# EAGLE design TeensyBreakout_Alpha1a (EAGLE 9.0.1)
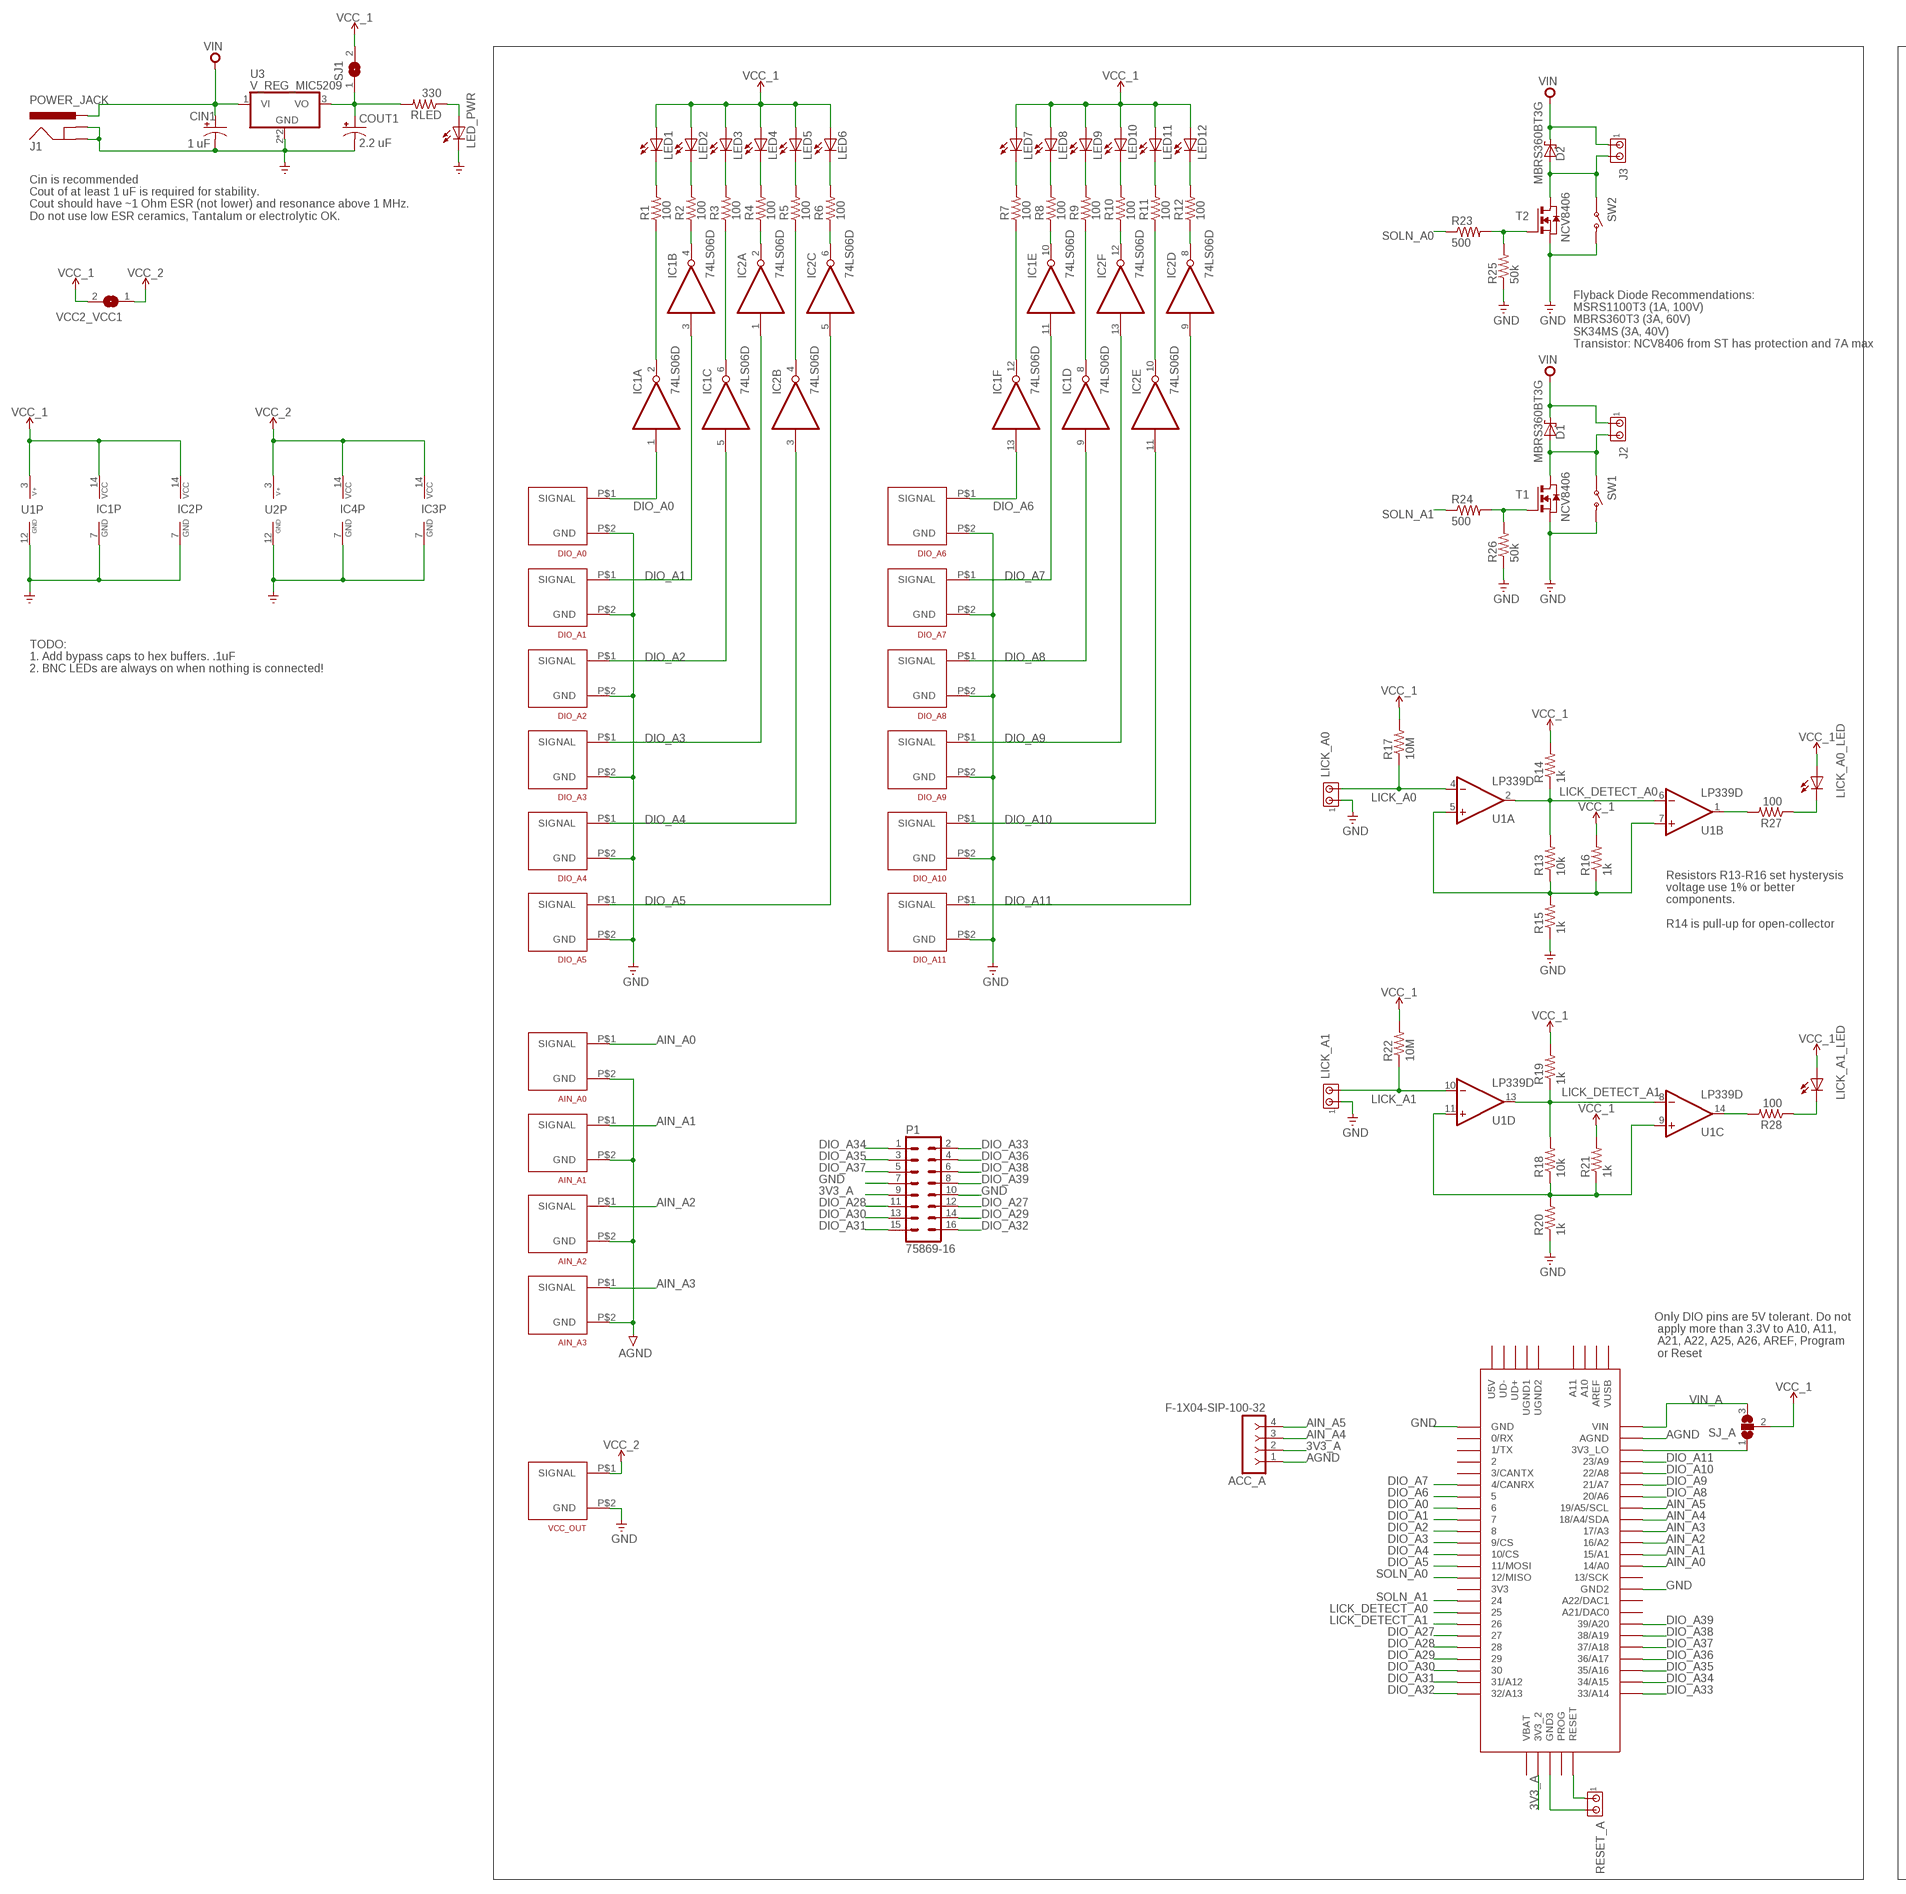
[diagram p0: schematic, sheet 1, part 1 of 2]
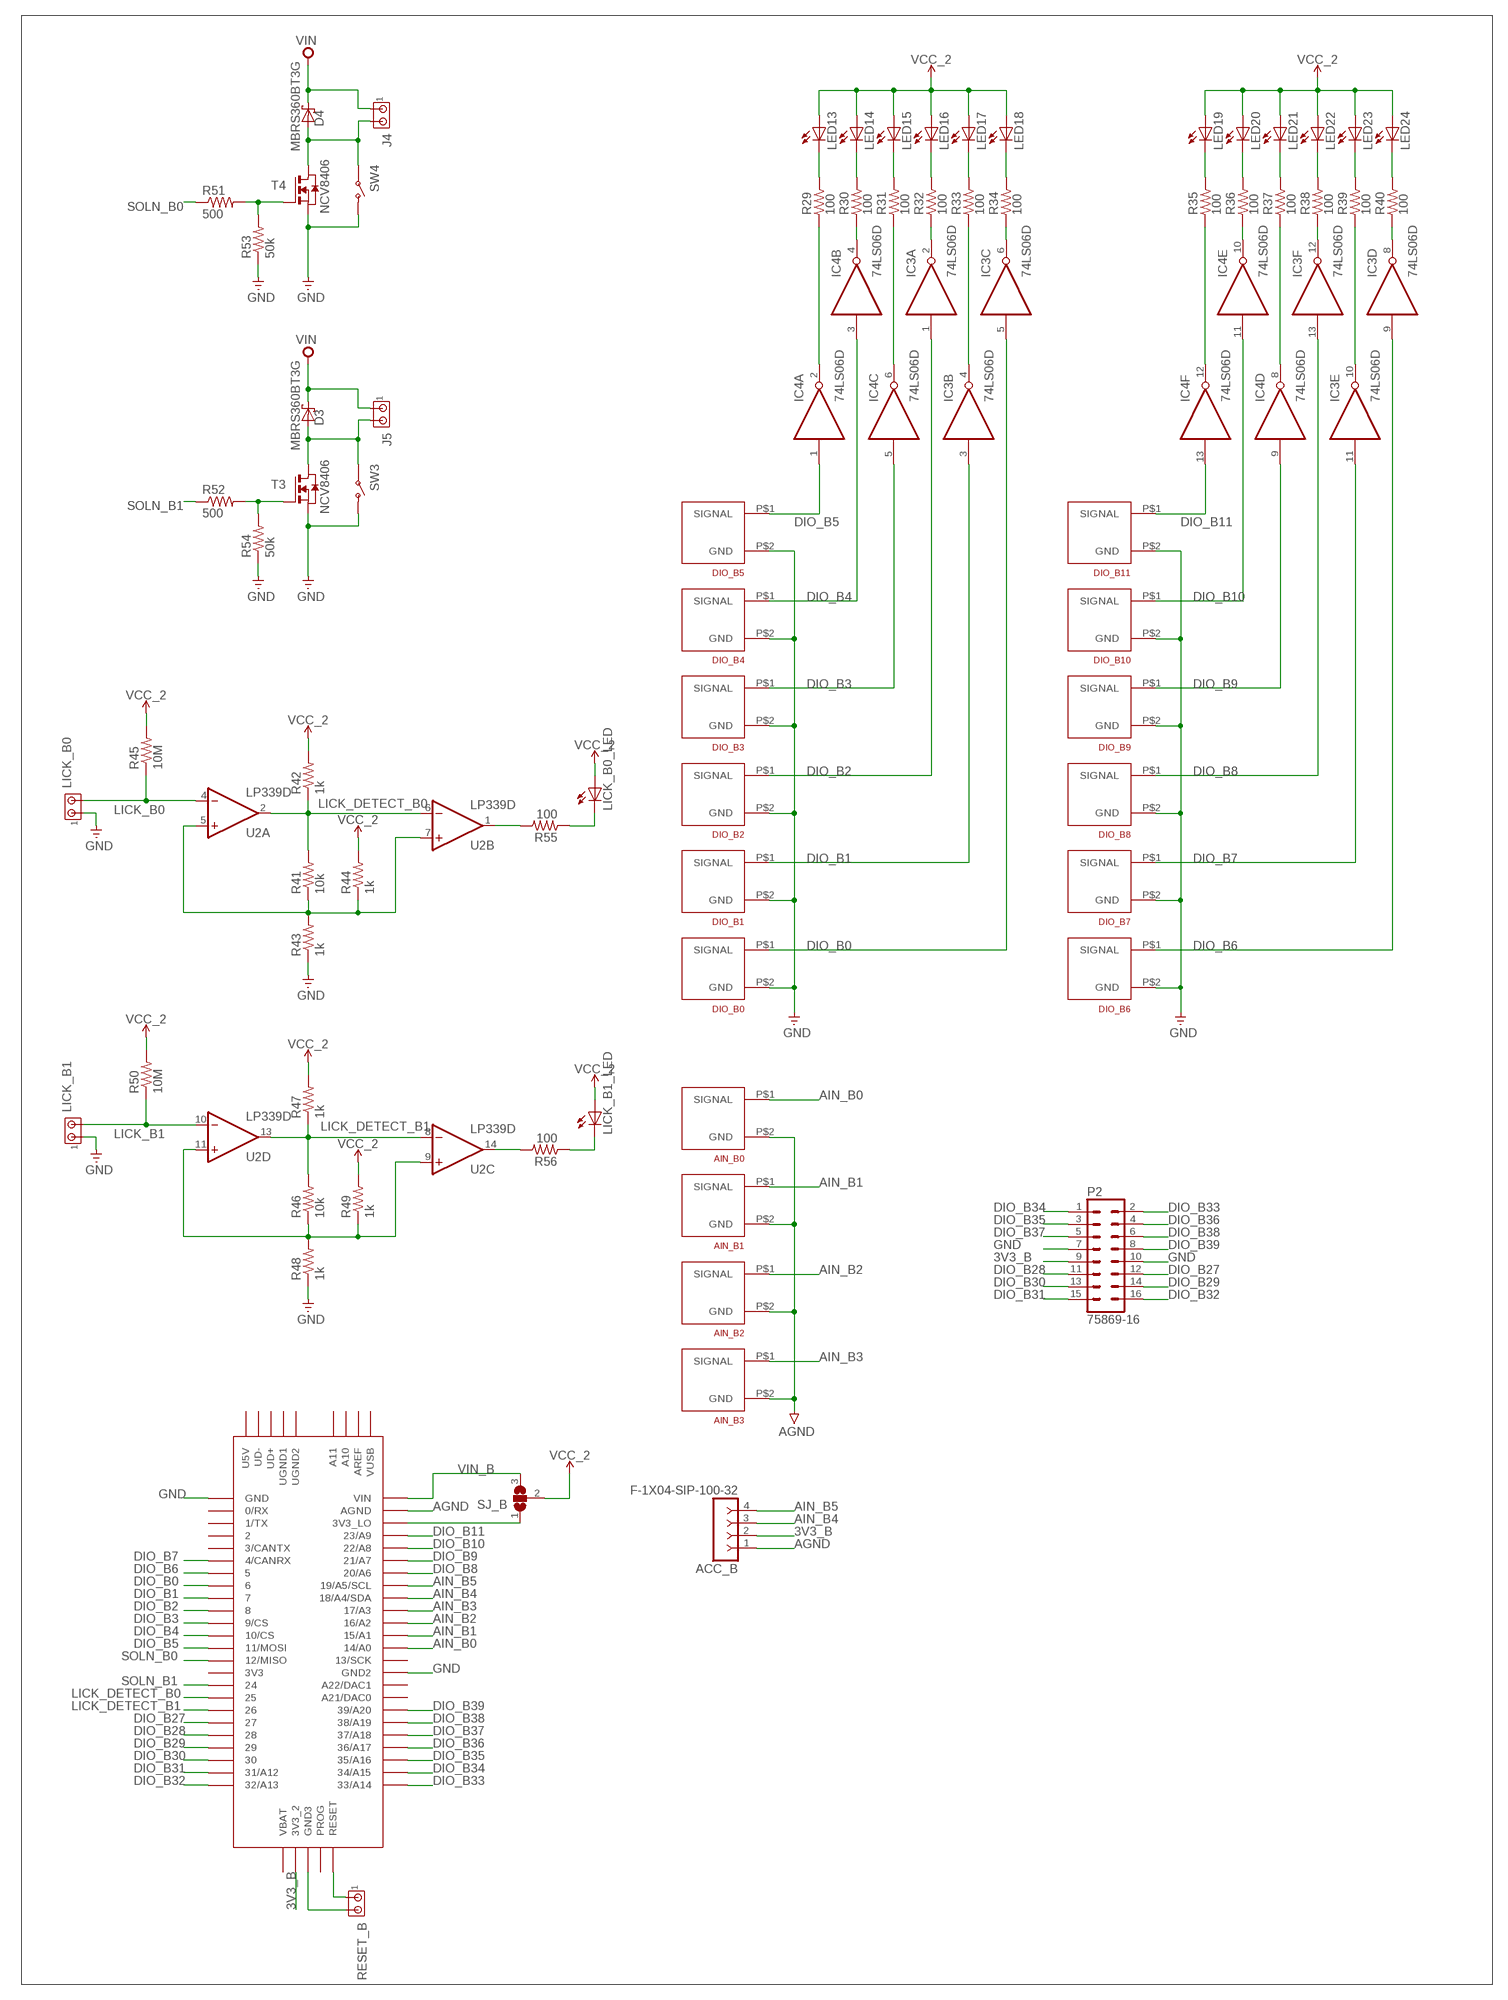
[diagram p1: schematic, sheet 1, part 2 of 2]

## Parts
ACC_A  F-1X04-SIP-100-32  [SIP-100-04-32]
ACC_B  F-1X04-SIP-100-32  [SIP-100-04-32]
AIN_A0  BNC_VERTICAL  [BNC_VERTICAL]
AIN_A1  BNC_VERTICAL  [BNC_VERTICAL]
AIN_A2  BNC_VERTICAL  [BNC_VERTICAL]
AIN_A3  BNC_VERTICAL  [BNC_VERTICAL]
AIN_B0  BNC_VERTICAL  [BNC_VERTICAL]
AIN_B1  BNC_VERTICAL  [BNC_VERTICAL]
AIN_B2  BNC_VERTICAL  [BNC_VERTICAL]
AIN_B3  BNC_VERTICAL  [BNC_VERTICAL]
CIN1  1 uF  CPOL-USE2.5-5  [E2,5-5]
COUT1  2.2 uF  CPOL-USE2.5-5  [E2,5-5]
D1  MBRS360BT3G  SCHOTTKY-DIODE  [DIODE_SMB]
D2  MBRS360BT3G  SCHOTTKY-DIODE  [DIODE_SMB]
D3  MBRS360BT3G  SCHOTTKY-DIODE  [DIODE_SMB]
D4  MBRS360BT3G  SCHOTTKY-DIODE  [DIODE_SMB]
DIO_A0  BNC_VERTICAL  [BNC_VERTICAL]
DIO_A1  BNC_VERTICAL  [BNC_VERTICAL]
DIO_A2  BNC_VERTICAL  [BNC_VERTICAL]
DIO_A3  BNC_VERTICAL  [BNC_VERTICAL]
DIO_A4  BNC_VERTICAL  [BNC_VERTICAL]
DIO_A5  BNC_VERTICAL  [BNC_VERTICAL]
DIO_A6  BNC_VERTICAL  [BNC_VERTICAL]
DIO_A7  BNC_VERTICAL  [BNC_VERTICAL]
DIO_A8  BNC_VERTICAL  [BNC_VERTICAL]
DIO_A9  BNC_VERTICAL  [BNC_VERTICAL]
DIO_A10  BNC_VERTICAL  [BNC_VERTICAL]
DIO_A11  BNC_VERTICAL  [BNC_VERTICAL]
DIO_B0  BNC_VERTICAL  [BNC_VERTICAL]
DIO_B1  BNC_VERTICAL  [BNC_VERTICAL]
DIO_B2  BNC_VERTICAL  [BNC_VERTICAL]
DIO_B3  BNC_VERTICAL  [BNC_VERTICAL]
DIO_B4  BNC_VERTICAL  [BNC_VERTICAL]
DIO_B5  BNC_VERTICAL  [BNC_VERTICAL]
DIO_B6  BNC_VERTICAL  [BNC_VERTICAL]
DIO_B7  BNC_VERTICAL  [BNC_VERTICAL]
DIO_B8  BNC_VERTICAL  [BNC_VERTICAL]
DIO_B9  BNC_VERTICAL  [BNC_VERTICAL]
DIO_B10  BNC_VERTICAL  [BNC_VERTICAL]
DIO_B11  BNC_VERTICAL  [BNC_VERTICAL]
IC1  74LS06D  [SO14]
IC2  74LS06D  [SO14]
IC3  74LS06D  [SO14]
IC4  74LS06D  [SO14]
J1  POWER_JACK  [POWER_JACK_PTH]
J2  MTA02-100  [10X02MTA]
J3  MTA02-100  [10X02MTA]
J4  MTA02-100  [10X02MTA]
J5  MTA02-100  [10X02MTA]
LED1  LED5MM  [LED5MM]
LED2  LED5MM  [LED5MM]
LED3  LED5MM  [LED5MM]
LED4  LED5MM  [LED5MM]
LED5  LED5MM  [LED5MM]
LED6  LED5MM  [LED5MM]
LED7  LED5MM  [LED5MM]
LED8  LED5MM  [LED5MM]
LED9  LED5MM  [LED5MM]
LED10  LED5MM  [LED5MM]
LED11  LED5MM  [LED5MM]
LED12  LED5MM  [LED5MM]
LED13  LED5MM  [LED5MM]
LED14  LED5MM  [LED5MM]
LED15  LED5MM  [LED5MM]
LED16  LED5MM  [LED5MM]
LED17  LED5MM  [LED5MM]
LED18  LED5MM  [LED5MM]
LED19  LED5MM  [LED5MM]
LED20  LED5MM  [LED5MM]
LED21  LED5MM  [LED5MM]
LED22  LED5MM  [LED5MM]
LED23  LED5MM  [LED5MM]
LED24  LED5MM  [LED5MM]
LED_PWR  LED5MM  [LED5MM]
LICK_A0  MTA02-100  [10X02MTA]
LICK_A0_LED  LED5MM  [LED5MM]
LICK_A1  MTA02-100  [10X02MTA]
LICK_A1_LED  LED5MM  [LED5MM]
LICK_B0  MTA02-100  [10X02MTA]
LICK_B0_LED  LED5MM  [LED5MM]
LICK_B1  MTA02-100  [10X02MTA]
LICK_B1_LED  LED5MM  [LED5MM]
P1  75869-16  [75869-16]
P2  75869-16  [75869-16]
R1  100  R_1206MP  [R1206MP]
R2  100  R_1206MP  [R1206MP]
R3  100  R_1206MP  [R1206MP]
R4  100  R_1206MP  [R1206MP]
R5  100  R_1206MP  [R1206MP]
R6  100  R_1206MP  [R1206MP]
R7  100  R_1206MP  [R1206MP]
R8  100  R_1206MP  [R1206MP]
R9  100  R_1206MP  [R1206MP]
R10  100  R_1206MP  [R1206MP]
R11  100  R_1206MP  [R1206MP]
R12  100  R_1206MP  [R1206MP]
R13  10k  R-US_M0805  [M0805]
R14  1k  R-US_M0805  [M0805]
R15  1k  R-US_M0805  [M0805]
R16  1k  R-US_M0805  [M0805]
R17  10M  R-US_M0805  [M0805]
R18  10k  R-US_M0805  [M0805]
R19  1k  R-US_M0805  [M0805]
R20  1k  R-US_M0805  [M0805]
R21  1k  R-US_M0805  [M0805]
R22  10M  R-US_M0805  [M0805]
R23  500  R-US_M1206  [M1206]
R24  500  R-US_M1206  [M1206]
R25  50k  R-US_M1206  [M1206]
R26  50k  R-US_M1206  [M1206]
R27  100  R_1206  [R1206]
R28  100  R_1206  [R1206]
R29  100  R_1206MP  [R1206MP]
R30  100  R_1206MP  [R1206MP]
R31  100  R_1206MP  [R1206MP]
R32  100  R_1206MP  [R1206MP]
R33  100  R_1206MP  [R1206MP]
R34  100  R_1206MP  [R1206MP]
R35  100  R_1206MP  [R1206MP]
R36  100  R_1206MP  [R1206MP]
R37  100  R_1206MP  [R1206MP]
R38  100  R_1206MP  [R1206MP]
R39  100  R_1206MP  [R1206MP]
R40  100  R_1206MP  [R1206MP]
R41  10k  R-US_M0805  [M0805]
R42  1k  R-US_M0805  [M0805]
R43  1k  R-US_M0805  [M0805]
R44  1k  R-US_M0805  [M0805]
R45  10M  R-US_M0805  [M0805]
R46  10k  R-US_M0805  [M0805]
R47  1k  R-US_M0805  [M0805]
R48  1k  R-US_M0805  [M0805]
R49  1k  R-US_M0805  [M0805]
R50  10M  R-US_M0805  [M0805]
R51  500  R-US_M1206  [M1206]
R52  500  R-US_M1206  [M1206]
R53  50k  R-US_M1206  [M1206]
R54  50k  R-US_M1206  [M1206]
R55  100  R_1206  [R1206]
R56  100  R_1206  [R1206]
RESET_A  MTA02-100  [10X02MTA]
RESET_B  MTA02-100  [10X02MTA]
RLED  330  R-US_R0805  [R0805]
SJ1  SJ  [SJ]
SJ_A  SJ2W  [SJ_2]
SJ_B  SJ2W  [SJ_2]
SW1  SWITCH-SPST-TH-V  [SWITCH-SPST-TH-APEM-5000]
SW2  SWITCH-SPST-TH-V  [SWITCH-SPST-TH-APEM-5000]
SW3  SWITCH-SPST-TH-V  [SWITCH-SPST-TH-APEM-5000]
SW4  SWITCH-SPST-TH-V  [SWITCH-SPST-TH-APEM-5000]
T1  NCV8406  NMOSSOT223  [SOT223]
T2  NCV8406  NMOSSOT223  [SOT223]
T3  NCV8406  NMOSSOT223  [SOT223]
T4  NCV8406  NMOSSOT223  [SOT223]
TEENSY_A  TEENSY_3.5/3.6  [TEENSY_3.5/3.6]
TEENSY_B  TEENSY_3.5/3.6  [TEENSY_3.5/3.6]
U1  LP339D  LM339D  [SO14]
U2  LP339D  LM339D  [SO14]
U3  V_REG_MIC5209  [SOT-223]
VCC2_VCC1  SJW  [SJW]
VCC_OUT  BNC_VERTICAL  [BNC_VERTICAL]

## Nets
3V3_A: ACC_A.2 P1.9 TEENSY_A.3V3_2
3V3_B: ACC_B.2 P2.9 TEENSY_B.3V3_2
AGND: ACC_A.1 ACC_B.1 AIN_A0.P$2(GND) AIN_A1.P$2(GND) AIN_A2.P$2(GND) AIN_A3.P$2(GND) AIN_B0.P$2(GND) AIN_B1.P$2(GND) AIN_B2.P$2(GND) AIN_B3.P$2(GND) TEENSY_A.AGND TEENSY_B.AGND
AIN_A0: AIN_A0.P$1(SIGNAL) TEENSY_A.14/A0
AIN_A1: AIN_A1.P$1(SIGNAL) TEENSY_A.15/A1
AIN_A2: AIN_A2.P$1(SIGNAL) TEENSY_A.16/A2
AIN_A3: AIN_A3.P$1(SIGNAL) TEENSY_A.17/A3
AIN_A4: ACC_A.3 TEENSY_A.18/A4/SDA
AIN_A5: ACC_A.4 TEENSY_A.19/A5/SCL
AIN_B0: AIN_B0.P$1(SIGNAL) TEENSY_B.14/A0
AIN_B1: AIN_B1.P$1(SIGNAL) TEENSY_B.15/A1
AIN_B2: AIN_B2.P$1(SIGNAL) TEENSY_B.16/A2
AIN_B3: AIN_B3.P$1(SIGNAL) TEENSY_B.17/A3
AIN_B4: ACC_B.3 TEENSY_B.18/A4/SDA
AIN_B5: ACC_B.4 TEENSY_B.19/A5/SCL
DIO_A0: DIO_A0.P$1(SIGNAL) IC1.1(A:I) TEENSY_A.6
DIO_A1: DIO_A1.P$1(SIGNAL) IC1.3(B:I) TEENSY_A.7
DIO_A2: DIO_A2.P$1(SIGNAL) IC1.5(C:I) TEENSY_A.8
DIO_A3: DIO_A3.P$1(SIGNAL) IC2.1(A:I) TEENSY_A.9/CS
DIO_A4: DIO_A4.P$1(SIGNAL) IC2.3(B:I) TEENSY_A.10/CS
DIO_A5: DIO_A5.P$1(SIGNAL) IC2.5(C:I) TEENSY_A.11/MOSI
DIO_A6: DIO_A6.P$1(SIGNAL) IC1.13(F:I) TEENSY_A.5
DIO_A7: DIO_A7.P$1(SIGNAL) IC1.11(E:I) TEENSY_A.4/CANRX
DIO_A8: DIO_A8.P$1(SIGNAL) IC1.9(D:I) TEENSY_A.20/A6
DIO_A9: DIO_A9.P$1(SIGNAL) IC2.13(F:I) TEENSY_A.21/A7
DIO_A10: DIO_A10.P$1(SIGNAL) IC2.11(E:I) TEENSY_A.22/A8
DIO_A11: DIO_A11.P$1(SIGNAL) IC2.9(D:I) TEENSY_A.23/A9
DIO_A27: P1.12 TEENSY_A.27
DIO_A28: P1.11 TEENSY_A.28
DIO_A29: P1.14 TEENSY_A.29
DIO_A30: P1.13 TEENSY_A.30
DIO_A31: P1.15 TEENSY_A.31/A12
DIO_A32: P1.16 TEENSY_A.32/A13
DIO_A33: P1.2 TEENSY_A.33/A14
DIO_A34: P1.1 TEENSY_A.34/A15
DIO_A35: P1.3 TEENSY_A.35/A16
DIO_A36: P1.4 TEENSY_A.36/A17
DIO_A37: P1.5 TEENSY_A.37/A18
DIO_A38: P1.6 TEENSY_A.38/A19
DIO_A39: P1.8 TEENSY_A.39/A20
DIO_B0: DIO_B0.P$1(SIGNAL) IC3.5(C:I) TEENSY_B.6
DIO_B1: DIO_B1.P$1(SIGNAL) IC3.3(B:I) TEENSY_B.7
DIO_B2: DIO_B2.P$1(SIGNAL) IC3.1(A:I) TEENSY_B.8
DIO_B3: DIO_B3.P$1(SIGNAL) IC4.5(C:I) TEENSY_B.9/CS
DIO_B4: DIO_B4.P$1(SIGNAL) IC4.3(B:I) TEENSY_B.10/CS
DIO_B5: DIO_B5.P$1(SIGNAL) IC4.1(A:I) TEENSY_B.11/MOSI
DIO_B6: DIO_B6.P$1(SIGNAL) IC3.9(D:I) TEENSY_B.5
DIO_B7: DIO_B7.P$1(SIGNAL) IC3.11(E:I) TEENSY_B.4/CANRX
DIO_B8: DIO_B8.P$1(SIGNAL) IC3.13(F:I) TEENSY_B.20/A6
DIO_B9: DIO_B9.P$1(SIGNAL) IC4.9(D:I) TEENSY_B.21/A7
DIO_B10: DIO_B10.P$1(SIGNAL) IC4.11(E:I) TEENSY_B.22/A8
DIO_B11: DIO_B11.P$1(SIGNAL) IC4.13(F:I) TEENSY_B.23/A9
DIO_B27: P2.12 TEENSY_B.27
DIO_B28: P2.11 TEENSY_B.28
DIO_B29: P2.14 TEENSY_B.29
DIO_B30: P2.13 TEENSY_B.30
DIO_B31: P2.15 TEENSY_B.31/A12
DIO_B32: P2.16 TEENSY_B.32/A13
DIO_B33: P2.2 TEENSY_B.33/A14
DIO_B34: P2.1 TEENSY_B.34/A15
DIO_B35: P2.3 TEENSY_B.35/A16
DIO_B36: P2.4 TEENSY_B.36/A17
DIO_B37: P2.5 TEENSY_B.37/A18
DIO_B38: P2.6 TEENSY_B.38/A19
DIO_B39: P2.8 TEENSY_B.39/A20
GND: CIN1.- COUT1.- DIO_A0.P$2(GND) DIO_A1.P$2(GND) DIO_A2.P$2(GND) DIO_A3.P$2(GND) DIO_A4.P$2(GND) DIO_A5.P$2(GND) DIO_A6.P$2(GND) DIO_A7.P$2(GND) DIO_A8.P$2(GND) DIO_A9.P$2(GND) DIO_A10.P$2(GND) DIO_A11.P$2(GND) DIO_B0.P$2(GND) DIO_B1.P$2(GND) DIO_B2.P$2(GND) DIO_B3.P$2(GND) DIO_B4.P$2(GND) DIO_B5.P$2(GND) DIO_B6.P$2(GND) DIO_B7.P$2(GND) DIO_B8.P$2(GND) DIO_B9.P$2(GND) DIO_B10.P$2(GND) DIO_B11.P$2(GND) IC1.7(P:GND) IC2.7(P:GND) IC3.7(P:GND) IC4.7(P:GND) J1.GND J1.GNDBREAK LED_PWR.K(C) LICK_A0.1 LICK_A1.1 LICK_B0.1 LICK_B1.1 P1.7 P1.10 P2.7 P2.10 R15.1 R20.1 R25.1 R26.1 R43.1 R48.1 R53.1 R54.1 RESET_A.2 RESET_B.2 SW1.1(O) SW2.1(O) SW3.1(O) SW4.1(O) T1.3(S) T2.3(S) T3.3(S) T4.3(S) TEENSY_A.GND TEENSY_A.GND2 TEENSY_A.GND3 TEENSY_B.GND TEENSY_B.GND2 TEENSY_B.GND3 U1.12(P:GND) U2.12(P:GND) U3.2(GND) U3.4(GND) VCC_OUT.P$2(GND)
LICK_A0: LICK_A0.2 R17.1 U1.4(A:-IN)
LICK_A1: LICK_A1.2 R22.1 U1.10(D:-IN)
LICK_B0: LICK_B0.2 R45.1 U2.4(A:-IN)
LICK_B1: LICK_B1.2 R50.1 U2.10(D:-IN)
LICK_DETECT_A0: R13.2 R14.1 TEENSY_A.25 U1.2(A:OUT) U1.6(B:-IN)
LICK_DETECT_A1: R18.2 R19.1 TEENSY_A.26 U1.8(C:-IN) U1.13(D:OUT)
LICK_DETECT_B0: R41.2 R42.1 TEENSY_B.25 U2.2(A:OUT) U2.6(B:-IN)
LICK_DETECT_B1: R46.2 R47.1 TEENSY_B.26 U2.8(C:-IN) U2.13(D:OUT)
N$1: IC1.2(A:O) R1.1
N$2: IC1.4(B:O) R2.1
N$3: IC1.6(C:O) R3.1
N$4: IC2.2(A:O) R4.1
N$5: IC2.4(B:O) R5.1
N$6: IC2.6(C:O) R6.1
N$7: LED1.K(C) R1.2
N$8: LED2.K(C) R2.2
N$9: LED3.K(C) R3.2
N$10: LED4.K(C) R4.2
N$11: LED5.K(C) R5.2
N$12: LED6.K(C) R6.2
N$13: R18.1 R20.2 R21.1 U1.9(C:+IN) U1.11(D:+IN)
N$14: LED_PWR.A RLED.1
N$15: IC1.12(F:O) R7.1
N$16: IC1.10(E:O) R8.1
N$17: IC1.8(D:O) R9.1
N$18: IC2.12(F:O) R10.1
N$19: IC2.10(E:O) R11.1
N$20: IC2.8(D:O) R12.1
N$21: LED7.K(C) R7.2
N$22: LED8.K(C) R8.2
N$23: LED9.K(C) R9.2
N$24: LED10.K(C) R10.2
N$25: LED11.K(C) R11.2
N$26: LED12.K(C) R12.2
N$27: R13.1 R15.2 R16.1 U1.5(A:+IN) U1.7(B:+IN)
N$28: SJ_A.1 TEENSY_A.3V3_LO
N$30: COUT1.+ RLED.2 SJ1.1 U3.3(VO)
N$31: R23.2 R25.2 T2.1(G)
N$32: R27.2 U1.1(B:OUT)
N$33: R24.2 R26.2 T1.1(G)
N$35: LICK_A0_LED.K(C) R27.1
N$41: LICK_A1_LED.K(C) R28.1
N$44: R28.2 U1.14(C:OUT)
N$46: SJ_B.1 TEENSY_B.3V3_LO
N$91: IC4.4(B:O) R30.1
N$92: IC4.6(C:O) R31.1
N$93: IC3.2(A:O) R32.1
N$94: IC3.4(B:O) R33.1
N$95: IC3.6(C:O) R34.1
N$96: LED14.K(C) R30.2
N$97: LED15.K(C) R31.2
N$98: LED16.K(C) R32.2
N$99: LED17.K(C) R33.2
N$100: LED18.K(C) R34.2
N$102: IC4.12(F:O) R35.1
N$103: IC4.10(E:O) R36.1
N$104: IC4.8(D:O) R37.1
N$105: IC3.12(F:O) R38.1
N$106: IC3.10(E:O) R39.1
N$107: IC3.8(D:O) R40.1
N$108: LED19.K(C) R35.2
N$109: LED20.K(C) R36.2
N$110: LED21.K(C) R37.2
N$111: LED22.K(C) R38.2
N$112: LED23.K(C) R39.2
N$113: LED24.K(C) R40.2
N$115: R51.2 R53.2 T4.1(G)
N$116: R52.2 R54.2 T3.1(G)
N$117: IC4.2(A:O) R29.1
N$118: LED13.K(C) R29.2
N$119: R41.1 R43.2 R44.1 U2.5(A:+IN) U2.7(B:+IN)
N$128: R46.1 R48.2 R49.1 U2.9(C:+IN) U2.11(D:+IN)
N$132: R55.2 U2.1(B:OUT)
N$133: LICK_B0_LED.K(C) R55.1
N$134: LICK_B1_LED.K(C) R56.1
N$135: R56.2 U2.14(C:OUT)
RESET_A: RESET_A.1 TEENSY_A.RESET
RESET_B: RESET_B.1 TEENSY_B.RESET
SOLN_A0: R23.1 TEENSY_A.12/MISO
SOLN_A1: R24.1 TEENSY_A.24
SOLN_B0: R51.1 TEENSY_B.12/MISO
SOLN_B1: R52.1 TEENSY_B.24
VCC_1: IC1.14(P:VCC) IC2.14(P:VCC) LED1.A LED2.A LED3.A LED4.A LED5.A LED6.A LED7.A LED8.A LED9.A LED10.A LED11.A LED12.A LICK_A0_LED.A LICK_A1_LED.A R14.2 R16.2 R17.2 R19.2 R21.2 R22.2 SJ1.2 SJ_A.2 U1.3(P:V+) VCC2_VCC1.2
VCC_2: IC3.14(P:VCC) IC4.14(P:VCC) LED13.A LED14.A LED15.A LED16.A LED17.A LED18.A LED19.A LED20.A LED21.A LED22.A LED23.A LED24.A LICK_B0_LED.A LICK_B1_LED.A R42.2 R44.2 R45.2 R47.2 R49.2 R50.2 SJ_B.2 U2.3(P:V+) VCC2_VCC1.1 VCC_OUT.P$1(SIGNAL)
VIN: CIN1.+ D1.C(A) D2.C(A) D3.C(A) D4.C(A) J1.PWR J2.1 J3.1 J4.1 J5.1 U3.1(VI)
VIN_A: SJ_A.3 TEENSY_A.VIN
VIN_B: SJ_B.3 TEENSY_B.VIN
VOUT-2: D1.A(C) J2.2 SW1.2(P) T1.2(D) T1.4(D)
VOUT-3: D2.A(C) J3.2 SW2.2(P) T2.2(D) T2.4(D)
VOUT-5: D4.A(C) J4.2 SW4.2(P) T4.2(D) T4.4(D)
VOUT-6: D3.A(C) J5.2 SW3.2(P) T3.2(D) T3.4(D)
Unconnected: TEENSY_A.0/RX TEENSY_A.1/TX TEENSY_A.2 TEENSY_A.3/CANTX TEENSY_A.3V3 TEENSY_A.13/SCK TEENSY_A.21/DAC0(A21/DAC0) TEENSY_A.A10 TEENSY_A.A11 TEENSY_A.A22/DAC1 TEENSY_A.AREF TEENSY_A.PROG TEENSY_A.U5V TEENSY_A.UD+ TEENSY_A.UD- TEENSY_A.UGND1 TEENSY_A.UGND2 TEENSY_A.VBAT TEENSY_A.VUSB TEENSY_B.0/RX TEENSY_B.1/TX TEENSY_B.2 TEENSY_B.3/CANTX TEENSY_B.3V3 TEENSY_B.13/SCK TEENSY_B.21/DAC0(A21/DAC0) TEENSY_B.A10 TEENSY_B.A11 TEENSY_B.A22/DAC1 TEENSY_B.AREF TEENSY_B.PROG TEENSY_B.U5V TEENSY_B.UD+ TEENSY_B.UD- TEENSY_B.UGND1 TEENSY_B.UGND2 TEENSY_B.VBAT TEENSY_B.VUSB

## Notes on the sheet
- Cin is recommended
  Cout of at least 1 uF is required for stability. 
  Cout should have ~1 Ohm ESR (not lower) and resonance above 1 MHz. 
  Do not use low ESR ceramics, Tantalum or electrolytic OK.
- Flyback Diode Recommendations:
  MSRS1100T3 (1A, 100V)
  MBRS360T3 (3A, 60V)
  SK34MS (3A, 40V)
  Transistor: NCV8406 from ST has protection and 7A max
- TODO:
  1. Add bypass caps to hex buffers. .1uF
  2. BNC LEDs are always on when nothing is connected!
- Resistors R13-R16 set hysterysis
  voltage use 1% or better
  components.
  
  R14 is pull-up for open-collector
- Only DIO pins are 5V tolerant. Do not
   apply more than 3.3V to A10, A11,
   A21, A22, A25, A26, AREF, Program
   or Reset

## Library data of the parts
ACC_A ACC_B = con-headers-jp:F-1X04-: FEMALE HEADER
AIN_A0 AIN_A1-AIN_A3 AIN_B0 AIN_B1-AIN_B3 DIO_A0 DIO_A1-DIO_A11 DIO_B0 DIO_B1-DIO_B11 VCC_OUT = connectors:BNC_VERTICAL: BNC plug, through-hole, vertical
CIN1 COUT1 = adafruit:CPOL-US: POLARIZED CAPACITOR, American symbol
D1-D4 = eagle-ltspice:SCHOTTKY-DIODE: Schottky Diode; SPICEMODEL: NONE; SPICEPREFIX: D; SPICETYPE: diode
IC1-IC4 = 74xx-eu:74*06: Hex INVERTER, open collector high-voltage output
J1 = SparkFun-Connectors:POWER_JACK: Power Jack Connector This is the standard 5.5mm barrel jack for power. The PTH is the most common, proven, reliable, footprint. The Slot footprint only works if the mill layer is transmitted to the PCB fab house so be warned. Here are the connectors we sell at SparkFun: DC Barrel Power Jack/Connector <https://www.sparkfun.com/products/119> (PRT-00119) DC Barrel Power Jack/Connector (SMD) <https://www.sparkfun.com/products/12748> (PRT-12748) DC Barrel Jack Adapter - Breadboard Compatible <https://www.sparkfun.com/products/10811> (PRT-10811) It is used on this SparkFun product (and many, many others): SparkFun RedBoard - Programmed with Arduino <https://www.sparkfun.com/products/12757> (DEV-12757) Also, if you need a mating power supply or connector, please check these out: Wall Adapter Power Supply - 9VDC 650mA <https://www.sparkfun.com/products/298> (TOL-00298) DC Barrel Jack Adapter - Male <https://www.sparkfun.com/products/10287> (PRT-10287); PROD_ID: CONN-08197
J2-J5 LICK_A0 LICK_A1 LICK_B0 LICK_B1 RESET_A RESET_B = con-amp:MTA02-100: AMP connector
LED1-LED24 LED_PWR LICK_A0_LED LICK_A1_LED LICK_B0_LED LICK_B1_LED = adafruit:LED: LED OSRAM: - CHIPLED LG R971, LG N971, LY N971, LG Q971, LY Q971, LO R971, LY R971 LH N974, LH R974 LS Q976, LO Q976, LY Q976 LO Q996 - Hyper CHIPLED LW Q18S LB Q993, LB Q99A, LB R99A - SideLED LS A670, LO A670, LY A670, LG A670, LP A670 LB A673, LV A673, LT A673, LW A673 LH A674 LY A675 LS A676, LA A676, LO A676, LY A676, LW A676 LS A679, LY A679, LG A679 - Hyper Micro SIDELED® LS Y876, LA Y876, LO Y876, LY Y876 LT Y87S - SmartLED LW L88C, LW L88S LB L89C, LB L89S, LG L890 LS L89K, LO L89K, LY L89K LS L896, LA L896, LO L896, LY L896 - TOPLED LS T670, LO T670, LY T670, LG T670, LP T670 LSG T670, LSP T670, LSY T670, LOP T670, LYG T670 LG T671, LOG T671, LSG T671 LB T673, LV T673, LT T673, LW T673 LH T674 LS T676, LA T676, LO T676, LY T676, LB T676, LH T676, LSB T676, LW T676 LB T67C, LV T67C, LT T67C, LS T67K, LO T67K, LY T67K, LW E67C LS E67B, LA E67B, LO E67B, LY E67B, LB E67C, LV E67C, LT E67C LW T67C LS T679, LY T679, LG T679 LS T770, LO T770, LY T770, LG T770, LP T770 LB T773, LV T773, LT T773, LW T773 LH T774 LS E675, LA E675, LY E675, LS T675 LS T776, LA T776, LO T776, LY T776, LB T776 LHGB T686 LT T68C, LB T68C - Hyper Mini TOPLED® LB M676 - Mini TOPLED Santana® LG M470 LS M47K, LO M47K, LY M47K Source: http://www.osram.convergy.de/
P1 P2 = con-fci-quickie:75869-16: HEADER
R1-R12 R27-R40 R55 R56 = rc-master:R_: RESISTOR
R13-R26 R41-R54 = adafruit:R-US_: RESISTOR, American symbol
RLED = rcl:R-US_: RESISTOR, American symbol; SPICEPREFIX: R
SJ1 VCC2_VCC1 = jumper:SJ: SMD solder JUMPER
SJ_A SJ_B = jumper:SJ2W: SMD solder JUMPER
SW1-SW4 = Pavel_ElectroMechanical:SWITCH-SPST-TH-V
T1-T4 = zetex:NMOSSOT223: MOS FET; OC_FARNELL: unknown; OC_NEWARK: unknown
TEENSY_A TEENSY_B = Teensy356:TEENSY_3.5/3.6
U1 U2 = op-amp:LM339: COMPARATOR - Quad Low Power Low Offset Voltage with open collector; LM139/LM239/LM339/LM2901/LM3302
U3 = Pavel-PowerIC:V_REG_MIC5209

## Board
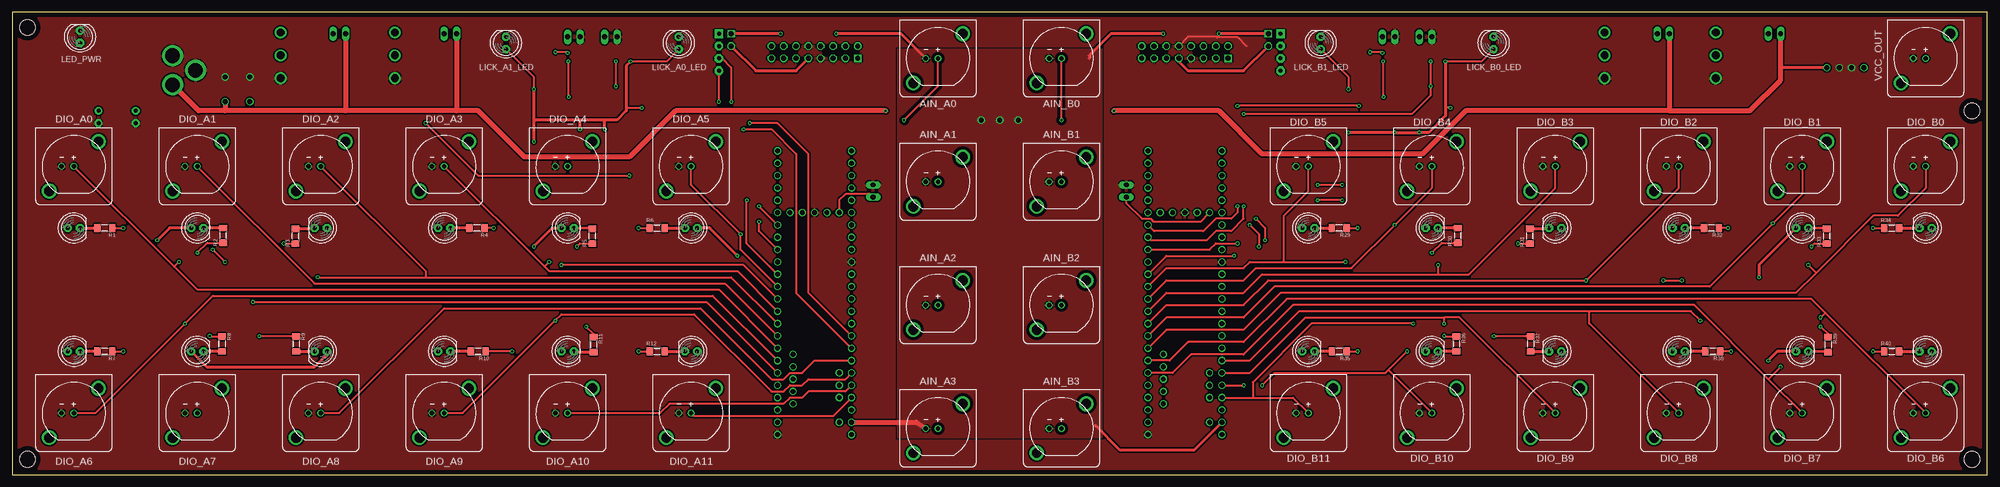
[diagram p2: board, top side]
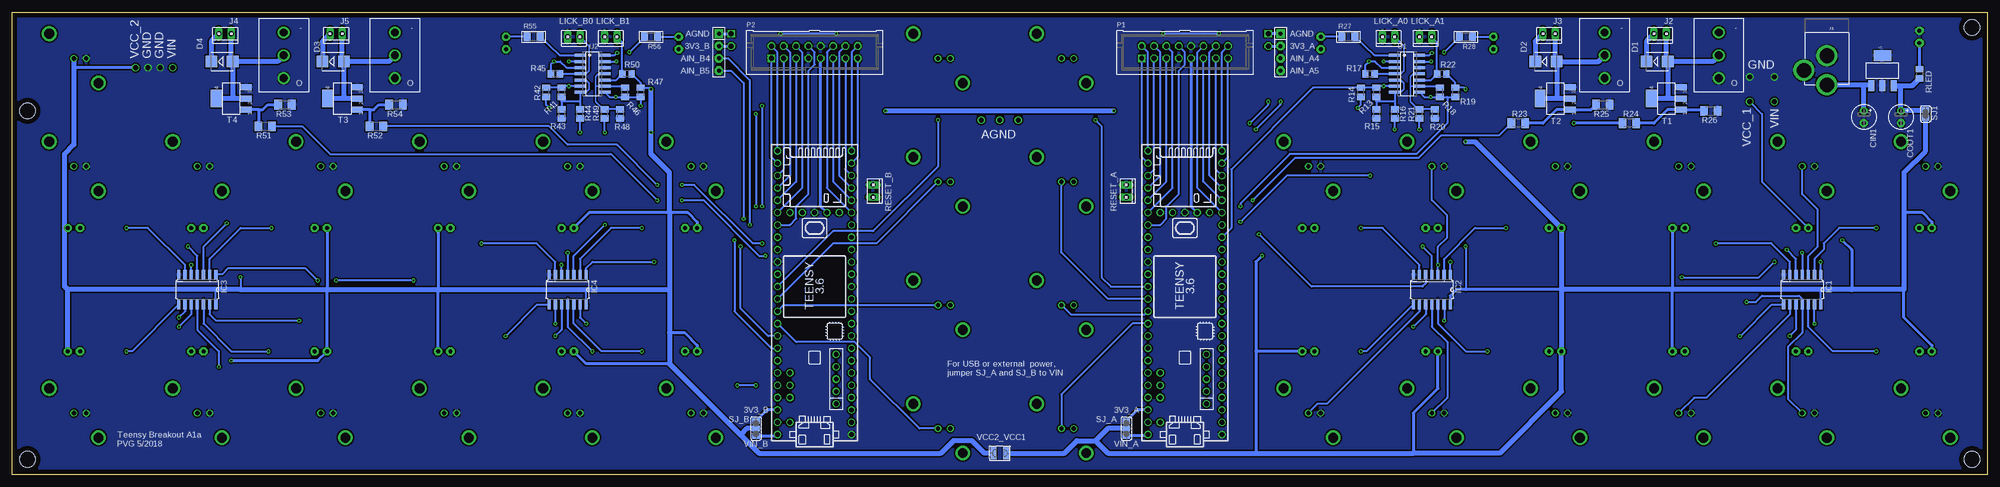
[diagram p3: board, bottom side, seen from below]

Size 406.4 x 95.25 mm. Coordinates in mm from the lower left corner, seen from the top.
Outline: 0,0 406.38,0 406.4,95.25 0,95.25 0,0
Copper layers (1*16): Top 0.035mm / dielectric 1.5mm / Bottom 0.035mm
Design rules "default": minimum track width 6mil, minimum drill 0.35mm, track to track 6mil, track to pad 6mil, pad to pad 6mil, via to via 6mil, smd to smd 6mil, copper to edge 40mil, drill to drill 6mil, minimum pad ring 10mil, minimum via ring 8mil, stop-mask expansion 4mil, vias tented up to drill 0mil, thermal gap 10mil
Holes 3.26 mm at 3.17,3.17 3.17,92.08 403.23,3.17 403.23,74.93

### Footprints (pad centres in the part's own frame; a part is rotated, then mirrored left to right if it is on the bottom)
SIP-100-04-32 = drill 0.813 pad 1.778 square: 1 -3.81,0 | drill 0.813 pad 1.778 octagon: 2 -1.27,0; 3 1.27,0; 4 3.81,0
BNC_VERTICAL = drill 0.89: P$1 0,0; P$2 2.54,0 | drill 2.01: P$3 5.08,5.08; P$4 -5.08,-5.08
E2,5-5 = drill 0.813 pad 1.6: + -1.27,0 | drill 0.813 pad 1.6 octagon: - 1.27,0
DIODE_SMB = smd 2.4 x 2.4: A 2.2,0; C -2.2,0
SO14 = smd 0.66 x 2.032: 1 -3.81,-3.073; 2 -2.54,-3.073; 3 -1.27,-3.073; 4 0,-3.073; 5 1.27,-3.073; 6 2.54,-3.073; 7 3.81,-3.073; 8 3.81,3.073; 9 2.54,3.073; 10 1.27,3.073; 11 0,3.073; 12 -1.27,3.073; 13 -2.54,3.073; 14 -3.81,3.073
POWER_JACK_PTH = drill 2.997 pad 4.318: GND 0,7.7; GNDBREAK 4.7,10.7; PWR 0,13.7
10X02MTA = drill 1.016 long: 1 1.27,0; 2 -1.27,0
LED5MM = drill 0.813 pad 1.676 octagon: A -1.27,0; K 1.27,0
75869-16 = drill 1.016 square: 1 -8.89,-1.27 | drill 1.016 octagon: 2 -8.89,1.27; 3 -6.35,-1.27; 4 -6.35,1.27; 5 -3.81,-1.27; 6 -3.81,1.27; 7 -1.27,-1.27; 8 -1.27,1.27; 9 1.27,-1.27; 10 1.27,1.27; 11 3.81,-1.27; 12 3.81,1.27; 13 6.35,-1.27; 14 6.35,1.27; 15 8.89,-1.27; 16 8.89,1.27
R1206MP = smd 1.3 x 1.6: 1 -1.524,0; 2 1.524,0
M0805 = smd 1.3 x 1.6: 1 -0.95,0; 2 0.95,0
M1206 = smd 1.6 x 2: 1 -1.4,0; 2 1.4,0
R1206 = smd 1.4 x 1.8: 1 -1.329,0; 2 1.329,0
R0805 = smd 1.3 x 1.5: 1 -0.95,0; 2 0.95,0
SJ = smd 1.168 x 1.6: 1 -0.762,0; 2 0.762,0
SJ_2 = smd 1.168 x 1.6: 1 -1.524,0; 2 0,0; 3 1.524,0
SWITCH-SPST-TH-APEM-5000 = drill 1.6: 1 0,4.699; 2 0,0; 3 0,-4.699
SOT223 = smd 1.219 x 2.235: 1 -2.311,-3.099; 2 0,-3.099; 3 2.311,-3.099 | smd 3.6 x 2.2: 4 0,3.099
TEENSY_3.5/3.6 = drill 0.965: 0/RX -25.4,-7.62; 1/TX -22.86,-7.62; 2 -20.32,-7.62; 3/CANTX -17.78,-7.62; 3V3 7.62,-7.62; 3V3_2 17.78,-2.54; 3V3_LO -22.86,7.62; 4/CANRX -15.24,-7.62; 5 -12.7,-7.62; 6 -10.16,-7.62; 7 -7.62,-7.62; 8 -5.08,-7.62; 9/CS -2.54,-7.62; 10/CS 0,-7.62; 11/MOSI 2.54,-7.62; 12/MISO 5.08,-7.62; 13/SCK 5.08,7.62; 14/A0 2.54,7.62; 15/A1 0,7.62; 16/A2 -2.54,7.62; 17/A3 -5.08,7.62; 18/A4/SDA -7.62,7.62; 19/A5/SCL -10.16,7.62; 20/A6 -12.7,7.62; 21/A7 -15.24,7.62; 21/DAC0 12.7,7.62; 22/A8 -17.78,7.62; 23/A9 -20.32,7.62; 24 10.16,-7.62; 25 12.7,-7.62; 26 15.24,-7.62; 27 17.78,-7.62; 28 20.32,-7.62; 29 22.86,-7.62; 30 25.4,-7.62; 31/A12 27.94,-7.62; 32/A13 30.48,-7.62; 33/A14 30.48,7.62; 34/A15 27.94,7.62; 35/A16 25.4,7.62; 36/A17 22.86,7.62; 37/A18 20.32,7.62; 38/A19 17.78,7.62; 39/A20 15.24,7.62; A10 -17.78,5.08; A11 -15.24,5.08; A22/DAC1 10.16,7.62; AGND -25.4,7.62; AREF -20.32,5.08; GND -27.94,-7.62; GND2 7.62,7.62; GND3 17.78,0; PROG 17.78,2.54; RESET 17.78,5.08; U5V -21.59,-4.445; UD+ -16.51,-4.445; UD- -19.05,-4.445; UGND1 -13.97,-4.445; UGND2 -11.43,-4.445; VBAT 17.78,-5.08; VIN -27.94,7.62; VUSB -25.4,5.08
SO14' = smd 0.6 x 2.2: 1 -3.81,-2.6; 2 -2.54,-2.6; 3 -1.27,-2.6; 4 0,-2.6; 5 1.27,-2.6; 6 2.54,-2.6; 7 3.81,-2.6; 8 3.81,2.6; 9 2.54,2.6; 10 1.27,2.6; 11 0,2.6; 12 -1.27,2.6; 13 -2.54,2.6; 14 -3.81,2.6
SOT-223 = smd 1.219 x 2.235: 1 -2.311,-3.099; 2 0,-3.099; 3 2.311,-3.099 | smd 3.6 x 2.2: 4 0,3.099
SJW = smd 1.27 x 2.54: 1 -1.27,0; 2 1.27,0

### Placement (x,y rotation side)
ACC_A  145.41,87 270 bottom
ACC_B  260.99,87 270 bottom
AIN_A0  190.5,85.72 180 top
AIN_A1  190.5,60.33 180 top
AIN_A2  190.5,34.92 180 top
AIN_A3  190.5,9.53 180 top
AIN_B0  215.9,85.72 180 top
AIN_B1  215.9,60.33 180 top
AIN_B2  215.9,34.92 180 top
AIN_B3  215.9,9.53 180 top
CIN1  25.4,73.66 270 bottom
COUT1  17.78,73.66 270 bottom
D1  67.94,85.09 0 bottom
D2  90.81,85.09 0 bottom
D3  340.36,85.09 0 bottom
D4  363.22,85.09 0 bottom
DIO_A0  12.7,63.5 180 top
DIO_A1  38.1,63.5 180 top
DIO_A2  63.5,63.5 180 top
DIO_A3  88.9,63.5 180 top
DIO_A4  114.3,63.5 180 top
DIO_A5  139.7,63.5 180 top
DIO_A6  12.7,12.7 180 top
DIO_A7  38.1,12.7 180 top
DIO_A8  63.5,12.7 180 top
DIO_A9  88.9,12.7 180 top
DIO_A10  114.3,12.7 180 top
DIO_A11  139.7,12.7 180 top
DIO_B0  393.7,63.5 180 top
DIO_B1  368.3,63.5 180 top
DIO_B2  342.9,63.5 180 top
DIO_B3  317.5,63.5 180 top
DIO_B4  292.1,63.5 180 top
DIO_B5  266.7,63.5 180 top
DIO_B6  393.7,12.7 180 top
DIO_B7  368.3,12.7 180 top
DIO_B8  342.9,12.7 180 top
DIO_B9  317.5,12.7 180 top
DIO_B10  292.1,12.7 180 top
DIO_B11  266.7,12.7 180 top
IC1  38.1,38.1 180 bottom
IC2  114.3,38.1 180 bottom
IC3  368.3,38.1 180 bottom
IC4  292.1,38.1 180 bottom
J1  33.02,93.98 180 bottom
J2  67.31,90.81 180 bottom
J3  90.17,90.81 180 bottom
J4  362.58,90.81 180 bottom
J5  339.73,90.81 180 bottom
LED1  12.7,50.8 0 top
LED2  38.1,50.8 0 top
LED3  63.5,50.8 180 top
LED4  88.9,50.8 0 top
LED5  114.3,50.8 0 top
LED6  139.7,50.8 180 top
LED7  12.7,25.4 0 top
LED8  38.1,25.4 0 top
LED9  63.5,25.4 180 top
LED10  88.9,25.4 0 top
LED11  114.3,25.4 0 top
LED12  139.7,25.4 180 top
LED13  266.7,50.8 0 top
LED14  292.1,50.8 0 top
LED15  317.5,50.8 180 top
LED16  342.9,50.8 0 top
LED17  368.3,50.8 0 top
LED18  393.7,50.8 180 top
LED19  266.7,25.4 0 top
LED20  292.1,25.4 0 top
LED21  317.5,25.4 180 top
LED22  342.9,25.4 0 top
LED23  368.3,25.4 0 top
LED24  393.7,25.4 180 top
LED_PWR  13.97,90.17 90 top
LICK_A0  123.19,90.17 180 bottom
LICK_A0_LED  137.16,88.9 90 top
LICK_A1  115.57,90.17 180 bottom
LICK_A1_LED  101.6,88.9 90 top
LICK_B0  290.83,90.17 180 bottom
LICK_B0_LED  304.8,88.9 90 top
LICK_B1  283.21,90.17 180 bottom
LICK_B1_LED  269.24,88.9 90 top
P1  165.1,87 0 bottom
P2  241.3,87 0 bottom
R1  19.05,50.8 180 top
R2  43.43,49.28 90 top
R3  58.29,49.15 90 top
R4  95.63,50.8 180 top
R5  119.38,49.15 90 top
R6  132.72,50.8 0 top
R7  19.05,25.4 180 top
R8  43.18,26.92 270 top
R9  58.42,26.92 270 top
R10  95.89,25.4 180 top
R11  119.63,26.8 270 top
R12  132.72,25.4 0 top
R13  125.73,78.74 90 bottom
R14  128.91,78.74 270 bottom
R15  125.73,74.3 90 bottom
R16  121.92,74.3 270 bottom
R17  127,82.55 180 bottom
R18  112.65,78.74 270 bottom
R19  109.47,78.74 90 bottom
R20  113.67,74.3 90 bottom
R21  116.84,74.3 270 bottom
R22  112.27,82.55 0 bottom
R23  96.52,72.39 0 bottom
R24  73.66,72.39 0 bottom
R25  79.12,76.2 180 bottom
R26  56.9,74.93 180 bottom
R27  131.44,90.17 0 bottom
R28  107.31,90.17 180 bottom
R29  273.05,50.8 180 top
R30  297.43,49.28 90 top
R31  312.29,49.15 90 top
R32  349.63,50.8 180 top
R33  373.38,49.15 90 top
R34  386.71,50.8 0 top
R35  273.05,25.4 180 top
R36  297.18,26.92 270 top
R37  312.42,26.92 270 top
R38  349.88,25.4 180 top
R39  373.63,26.8 270 top
R40  386.71,25.4 0 top
R41  293.37,78.74 90 bottom
R42  296.55,78.74 270 bottom
R43  293.37,74.3 90 bottom
R44  289.56,74.3 270 bottom
R45  294.64,82.55 180 bottom
R46  280.29,78.74 270 bottom
R47  277.11,78.74 90 bottom
R48  281.31,74.3 90 bottom
R49  284.48,74.3 270 bottom
R50  279.91,82.55 0 bottom
R51  354.33,71.75 180 bottom
R52  331.47,71.75 180 bottom
R53  350.27,76.2 180 bottom
R54  327.41,76.2 180 bottom
R55  299.08,90.17 0 bottom
R56  274.95,90.17 180 bottom
RESET_A  177.16,58.42 270 bottom
RESET_B  229.24,58.42 270 bottom
RLED  13.97,82.55 270 bottom
SJ1  12.7,74.3 270 bottom
SJ_A  177.16,9.53 270 bottom
SJ_B  253.37,9.53 270 bottom
SW1  55.24,86.36 180 bottom
SW2  78.74,86.36 180 bottom
SW3  327.66,86.36 180 bottom
SW4  350.52,86.36 180 bottom
T1  66.04,77.47 90 bottom
T2  88.9,77.47 90 bottom
T3  338.45,77.47 90 bottom
T4  361.31,77.47 90 bottom
TEENSY_A  165.1,36.2 90 bottom
TEENSY_B  241.3,36.2 90 bottom
U1  LP339D  [SO14']  119.38,82.55 270 bottom
U2  LP339D  [SO14']  287.02,82.55 270 bottom
U3  21.59,83.19 0 bottom
VCC2_VCC1  203.2,4.45 0 bottom
VCC_OUT  393.7,85.72 180 top

### Tracks (layer width: path | path; a pad name or v marks a point on that pad's centre or on a via)
3V3_A  (via drill 1)
  Top 0.61: v147.96,88.27 153.03,83.19 161.29,83.19 P1.9
  Bottom 0.61: P1.9 163.83,55.24 TEENSY_A.3V3_2 | v147.96,88.27 ACC_A.2
3V3_B  (via drill 1)
  Top 0.61: P2.9 240.03,85.09 241.94,83.19 253.37,83.19 v258.44,88.27
  Bottom 0.61: TEENSY_B.3V3_2 240.03,55.24 P2.9 | ACC_B.2 v258.44,88.27
AGND  (via drill 0.35, 1)
  Top 0.61: TEENSY_B.AGND 243.21,5.08 227.97,5.08 222.88,10.16 | AIN_A0.P$2 182.88,90.81 v169.54,90.81 | v158.12,90.81 v147.96,90.81 | v258.44,90.81 v248.28,90.81 | v236.85,90.81 226.06,90.81 221.62,86.36 221.62,85.72
  Top 1.016: TEENSY_A.AGND 186.06,10.79 AIN_A3.P$2
  Bottom 0.61: v169.54,90.81 v158.12,90.81 | ACC_A.1 v147.96,90.81 | ACC_B.1 v258.44,90.81 | v248.28,90.81 v236.85,90.81
  other vias: 199.39,73.03 203.2,73.03 207.01,73.03
  pour Top (isolate 0.61): 182.25,87.63 224.16,87.63 224.16,7.62 182.25,7.62
AIN_A0  (via drill 0.35)
  Top 0.406: v183.51,73.03 190.5,80.01 AIN_A0.P$1
  Bottom 0.406: v183.51,73.03 182.25,71.75 182.25,40.64 180.34,38.73 TEENSY_A.14/A0
AIN_A1
  Bottom 0.406: TEENSY_A.15/A1 180.97,36.2 190.5,45.72 AIN_A1.P$1
AIN_A2
  Bottom 0.406: AIN_A2.P$1 188.59,33.02 173.35,33.02 TEENSY_A.16/A2
AIN_A3
  Bottom 0.406: TEENSY_A.17/A3 175.9,31.11 190.5,16.51 AIN_A3.P$1
AIN_A4  (via drill 0.35)
  Top 0.406: TEENSY_A.18/A4/SDA 163.83,37.47 163.83,66.04 157.48,72.39 v151.76,72.39 | v147.96,76.83 147.96,83.82 146.05,85.72 ACC_A.3
  Bottom 0.406: v151.76,72.39 147.96,76.2 v147.96,76.83
AIN_A5  (via drill 0.35)
  Top 0.406: TEENSY_A.19/A5/SCL 161.29,37.47 161.29,66.04 156.21,71.12 v150.5,71.12 | v145.41,76.83 ACC_A.4
  Bottom 0.406: v150.5,71.12 145.41,76.2 v145.41,76.83
AIN_B0  (via drill 0.35)
  Top 0.406: v215.9,73.03 AIN_B0.P$1
  Bottom 0.406: TEENSY_B.14/A0 237.49,50.16 229.24,50.16 215.9,63.5 v215.9,73.03
AIN_B1
  Bottom 0.406: TEENSY_B.15/A1 237.49,47.62 228.6,47.62 AIN_B1.P$1
AIN_B2
  Bottom 0.406: TEENSY_B.16/A2 247.65,34.92 AIN_B2.P$1
AIN_B3
  Bottom 0.406: TEENSY_B.17/A3 245.11,27.3 233.04,27.3 229.87,24.13 229.87,19.68 219.71,9.53 AIN_B3.P$1
AIN_B4  (via drill 0.35)
  Top 0.406: v254.63,51.44 256.54,49.53 v256.54,46.99
  Bottom 0.406: TEENSY_B.18/A4/SDA 250.82,28.57 256.54,34.29 v256.54,46.99 | v254.63,51.44 254.63,81.28 259.08,85.72 ACC_B.3
AIN_B5  (via drill 0.35)
  Top 0.406: v255.91,52.7 257.81,50.8 v257.81,48.26
  Bottom 0.406: TEENSY_B.19/A5/SCL 250.19,26.04 257.81,33.66 v257.81,48.26 | ACC_B.4 258.44,83.19 255.91,80.64 v255.91,52.7
DIO_A0  (via drill 0.35)
  Top 0.406: DIO_A0.P$1 33.34,42.86 | 33.34,42.86 38.1,38.1 145.41,38.1 TEENSY_A.6 | v34.29,43.81 33.34,42.86
  Bottom 0.406: 34.29,41.91 IC1.1 v34.29,43.81
DIO_A1
  Top 0.406: DIO_A1.P$1 62.23,39.37 146.69,39.37 TEENSY_A.7
  Bottom 0.406: DIO_A1.P$1 38.1,57.78 34.92,54.61 34.92,46.99 36.83,45.09 IC1.3
DIO_A2  (via drill 0.35)
  Top 0.406: v62.87,40.64 85.09,40.64 | DIO_A2.P$1 85.09,41.91 85.09,40.64 | v43.81,43.81 v41.27,46.35 | TEENSY_A.8 147.96,40.64 85.09,40.64
  Bottom 0.406: v41.27,46.35 39.37,44.45 IC1.5 | v62.87,40.64 46.99,40.64 v43.81,43.81
DIO_A3  (via drill 0.35)
  Top 0.406: DIO_A3.P$1 109.54,42.86 | 109.54,42.86 110.49,41.91 149.22,41.91 TEENSY_A.9/CS | v110.49,43.81 109.54,42.86
  Bottom 0.406: 110.49,41.91 IC2.1 v110.49,43.81
DIO_A4  (via drill 0.35)
  Top 0.406: v113.03,43.18 150.5,43.18 TEENSY_A.10/CS
  Bottom 0.406: DIO_A4.P$1 114.3,56.52 111.12,53.34 111.12,48.9 113.03,46.99 v113.03,43.18 IC2.3
DIO_A5  (via drill 0.35)
  Top 0.406: DIO_A5.P$1 139.7,59.69 v149.86,49.53 149.86,46.35 TEENSY_A.11/MOSI
  Bottom 0.406: IC2.5 115.57,39.37 116.2,38.73 139.06,38.73 v149.86,49.53
DIO_A6  (via drill 0.35)
  Top 0.406: DIO_A6.P$1 17.14,12.7 v35.56,31.11 41.27,36.83 144.15,36.83 TEENSY_A.5
  Bottom 0.406: v35.56,31.11 IC1.13
DIO_A7  (via drill 0.35)
  Top 0.406: TEENSY_A.4/CANRX 142.88,35.56 v49.53,35.56
  Bottom 0.406: v49.53,35.56 47.62,35.56 46.35,36.83 38.73,36.83 38.1,36.2 IC1.11 38.1,29.21 41.02,26.29 41.02,15.62 DIO_A7.P$1
DIO_A8
  Top 0.406: DIO_A8.P$1 67.31,12.7 88.9,34.29 141.6,34.29 156.21,19.68 158.75,19.68 160.02,20.95 162.56,20.95 165.1,23.5 TEENSY_A.20/A6
  Bottom 0.406: IC1.9 40.64,33.02 57.78,15.88 60.33,15.88 DIO_A8.P$1
DIO_A9  (via drill 0.35)
  Top 0.406: DIO_A9.P$1 92.71,12.7 v111.76,31.75 113.03,33.02 140.34,33.02 156.21,17.14 158.75,17.14 160.02,18.41 162.56,18.41 163.83,19.68 171.45,19.68 TEENSY_A.21/A7
  Bottom 0.406: IC2.13 v111.76,31.75
DIO_A10
  Top 0.406: DIO_A10.P$1 133.35,12.7 135.25,14.61 158.75,14.61 160.02,15.88 162.56,15.88 163.83,17.14 171.45,17.14 TEENSY_A.22/A8
  Bottom 0.406: IC2.11 114.3,30.48 111.12,27.3 111.12,15.88 DIO_A10.P$1
DIO_A11
  Top 0.406: TEENSY_A.23/A9 168.91,12.06 140.34,12.06 DIO_A11.P$1
  Bottom 0.406: IC2.9 116.84,33.66 135.89,14.61 137.79,14.61 DIO_A11.P$1
DIO_A27
  Bottom 0.406: TEENSY_A.27 162.56,59.05 162.56,87 P1.12
DIO_A28
  Bottom 0.406: TEENSY_A.28 161.29,60.33 P1.11
DIO_A29
  Bottom 0.406: TEENSY_A.29 160.02,61.59 160.02,87 P1.14
DIO_A30
  Bottom 0.406: TEENSY_A.30 158.75,62.87 P1.13
DIO_A31
  Bottom 0.406: TEENSY_A.31/A12 156.21,65.41 P1.15
DIO_A32
  Bottom 0.406: TEENSY_A.32/A13 157.48,87 P1.16
DIO_A33
  Bottom 0.406: TEENSY_A.33/A14 172.72,87 P1.2
DIO_A34
  Bottom 0.406: TEENSY_A.34/A15 173.99,65.41 P1.1
DIO_A35
  Bottom 0.406: TEENSY_A.35/A16 171.45,62.87 P1.3
DIO_A36
  Bottom 0.406: TEENSY_A.36/A17 170.18,61.59 170.18,87 P1.4
DIO_A37
  Bottom 0.406: TEENSY_A.37/A18 168.91,60.33 P1.5
DIO_A38
  Bottom 0.406: TEENSY_A.38/A19 167.64,59.05 167.64,87 P1.6
DIO_A39
  Bottom 0.406: TEENSY_A.39/A20 170.18,51.44 168.91,52.7 168.91,55.24 166.37,57.78 166.37,83.19 165.1,84.45 165.1,87 P1.8
DIO_B0  (via drill 0.35)
  Top 0.406: DIO_B0.P$1 393.7,59.05 387.99,53.34 382.9,53.34 371.16,41.59 | 371.16,41.59 367.03,37.47 260.99,37.47 253.37,29.84 237.49,29.84 TEENSY_B.6 | v369.57,43.18 371.16,41.59
  Bottom 0.406: IC3.5 v369.57,43.18
DIO_B1  (via drill 0.35)
  Top 0.406: DIO_B1.P$1 368.3,57.78 v362.27,51.75 349.25,38.73 259.71,38.73 253.37,32.38 237.49,32.38 TEENSY_B.7
  Bottom 0.406: IC3.3 367.03,46.99 v362.27,51.75
DIO_B2  (via drill 0.35)
  Top 0.406: DIO_B2.P$1 342.9,59.05 v323.85,40.01 258.44,40.01 253.37,34.92 237.49,34.92 TEENSY_B.8 | v339.73,40.01 v343.54,40.01
  Bottom 0.406: 364.49,41.91 IC3.1 364.39,41.27 363.22,41.27 361.95,42.55 346.07,42.55 v343.54,40.01 | v323.85,40.01 v339.73,40.01
DIO_B3  (via drill 0.35)
  Top 0.406: DIO_B3.P$1 317.5,59.05 299.72,41.27 293.37,41.27 | 293.37,41.27 257.18,41.27 253.37,37.47 237.49,37.47 TEENSY_B.9/CS | v293.37,43.18 293.37,41.27
  Bottom 0.406: IC4.5 v293.37,43.18
DIO_B4  (via drill 0.35)
  Top 0.406: DIO_B4.P$1 292.1,59.05 v284.48,51.44 275.59,42.55 255.91,42.55 253.37,40.01 237.49,40.01 TEENSY_B.10/CS
  Bottom 0.406: IC4.3 290.83,45.09 v284.48,51.44
DIO_B5  (via drill 0.35)
  Top 0.406: DIO_B5.P$1 266.7,58.42 261.62,53.34 261.62,43.81 | TEENSY_B.11/MOSI 237.49,42.55 253.37,42.55 254.63,43.81 261.62,43.81 | 261.62,43.81 v274.32,43.81
  Bottom 0.406: 288.29,41.91 IC4.1 288.29,42.55 287.02,43.81 v274.32,43.81
DIO_B6  (via drill 0.35)
  Top 0.406: DIO_B6.P$1 373.06,33.34 | 373.06,33.34 370.2,36.2 262.25,36.2 253.37,27.3 241.94,27.3 238.12,23.5 TEENSY_B.5 | v372.11,32.38 373.06,33.34
  Bottom 0.406: IC3.9 370.84,33.66 v372.11,32.38
DIO_B7  (via drill 0.35)
  Top 0.406: DIO_B7.P$1 361.31,19.68 | 361.31,19.68 346.07,34.92 263.52,34.92 253.37,24.77 242.57,24.77 238.76,20.95 TEENSY_B.4/CANRX | v363.86,22.23 361.31,19.68
  Bottom 0.406: v363.86,22.23 363.86,25.4 368.3,29.84 IC3.11
DIO_B8  (via drill 0.35)
  Top 0.406: 324.49,33.66 345.44,33.66 v347.35,31.75 | DIO_B8.P$1 324.49,31.11 324.49,33.66 | TEENSY_B.20/A6 254.63,23.5 264.8,33.66 324.49,33.66
  Bottom 0.406: IC3.13 365.76,33.02 364.49,31.75 v347.35,31.75
DIO_B9  (via drill 0.35)
  Top 0.406: DIO_B9.P$1 297.81,32.38 294.64,32.38 | v294.64,31.11 294.64,32.38 | 294.64,32.38 266.06,32.38 254.63,20.95 TEENSY_B.21/A7
  Bottom 0.406: IC4.9 v294.64,31.11
DIO_B10  (via drill 0.35)
  Top 0.406: DIO_B10.P$1 283.21,21.59 | v287.02,25.4 283.21,21.59 | 283.21,21.59 282.57,20.95 259.71,20.95 v257.18,18.41 | TEENSY_B.22/A8 v253.37,18.41
  Bottom 0.406: 292.1,36.2 IC4.11 292.1,30.48 v287.02,25.4 | v253.37,18.41 v257.18,18.41
DIO_B11  (via drill 0.35)
  Top 0.406: TEENSY_B.23/A9 255.27,15.88 | 255.27,15.88 263.52,15.88 DIO_B11.P$1 | 255.27,15.88 255.27,19.05 267.33,31.11 v288.29,31.11
  Bottom 0.406: IC4.13 289.56,32.38 v288.29,31.11
DIO_B27
  Bottom 0.406: P2.12 238.76,87 238.76,59.05 TEENSY_B.27
DIO_B28
  Bottom 0.406: P2.11 237.49,60.33 TEENSY_B.28
DIO_B29
  Bottom 0.406: P2.14 236.22,87 236.22,61.59 TEENSY_B.29
DIO_B30
  Bottom 0.406: P2.13 234.95,62.87 TEENSY_B.30
DIO_B31
  Bottom 0.406: P2.15 232.41,65.41 TEENSY_B.31/A12
DIO_B32
  Bottom 0.406: P2.16 233.68,87 TEENSY_B.32/A13
DIO_B33
  Bottom 0.406: P2.2 248.92,87 TEENSY_B.33/A14
DIO_B34
  Bottom 0.406: TEENSY_B.34/A15 250.19,65.41 P2.1
DIO_B35
  Bottom 0.406: P2.3 247.65,62.87 TEENSY_B.35/A16
DIO_B36
  Bottom 0.406: P2.4 246.38,87 246.38,61.59 TEENSY_B.36/A17
DIO_B37
  Bottom 0.406: P2.5 245.11,60.33 TEENSY_B.37/A18
DIO_B38
  Bottom 0.406: P2.6 243.84,87 243.84,59.05 TEENSY_B.38/A19
DIO_B39
  Bottom 0.406: P2.8 241.3,87 241.3,84.45 242.57,83.19 242.57,57.78 245.11,55.24 245.11,52.7 246.38,51.44 TEENSY_B.39/A20
GND  (via drill 1)
  Top 0.406: P2.10 241.94,90.17 247.88,90.17 247.98,90.07 252.19,90.07 254,88.27
  other vias: 43.81,81.92 48.9,81.92 378.46,83.82 375.92,83.82
  pour Top (isolate 0.305, rank 2): -3.17,99.06 408.31,99.69 408.31,-3.81 -2.54,-2.54
  pour Bottom (isolate 0.305): -5.08,100.33 414.02,102.23 414.02,-5.71 -5.08,-7.62
LICK_A0
  Bottom 0.305: LICK_A0.2 120.02,88.27 120.02,83.19 120.65,82.55 121.92,82.55 U1.4
  Bottom 0.406: R17.1 121.92,82.55
LICK_A1
  Bottom 0.406: U1.10 114.49,81.28 R22.1 113.22,89.09 LICK_A1.2
LICK_B0
  Bottom 0.305: LICK_B0.2 287.65,88.27 287.65,83.19 288.29,82.55 289.56,82.55 U2.4
  Bottom 0.406: R45.1 289.56,82.55
LICK_B1
  Bottom 0.406: U2.10 282.13,81.28 R50.1 280.86,89.09 LICK_B1.2
LICK_DETECT_A0  (via drill 0.35)
  Top 0.406: v124.21,85.09 v124.21,80.01
  Bottom 0.406: U1.6 v124.21,80.01 125.41,80.01 R13.2 R14.1 138.75,79.69 155.57,62.87 155.57,50.8 TEENSY_A.25 | U1.2 v124.21,85.09
LICK_DETECT_A1  (via drill 0.35)
  Top 0.406: v114.43,85.09 114.43,77.85 114.55,77.72 v114.55,77.79 | TEENSY_A.26 v153.67,55.24
  Bottom 0.406: U1.8 115.83,77.79 v114.55,77.79 R18.2 111.12,77.79 | 111.12,77.79 R19.1 | U1.13 v114.43,85.09 | v153.67,55.24 153.67,55.88 143.51,66.04 117.47,66.04 111.12,72.39 111.12,77.79
LICK_DETECT_B0  (via drill 0.35)
  Top 0.406: v291.85,85.09 v291.85,80.01 291.85,78.11 288.04,74.3 v253.37,74.3 | v253.37,55.24 253.37,52.7 250.82,50.16 247.65,50.16 245.75,48.26 234.31,48.26 TEENSY_B.25
  Bottom 0.406: U2.6 v291.85,80.01 293.05,80.01 R41.2 R42.1 | U2.2 v291.85,85.09 | v253.37,74.3 v253.37,55.24
LICK_DETECT_B1  (via drill 0.35)
  Top 0.406: v282.07,85.09 282.07,77.85 282.19,77.72 v282.19,77.79 | v252.09,55.24 252.09,53.98 250.82,52.7 247.65,52.7 245.11,50.16 234.95,50.16 TEENSY_B.26 | v277.11,75.95 v252.09,75.95
  Bottom 0.406: U2.8 283.47,77.79 v282.19,77.79 R46.2 R47.1 v277.11,75.95 | U2.13 v282.07,85.09 | v252.09,75.95 v252.09,55.24
N$1  (via drill 0.35)
  Top 0.406: R1.1 v22.86,50.8
  Bottom 0.406: IC1.2 35.56,44.45 33.66,46.35 33.66,47.62 30.48,50.8 v22.86,50.8
N$2  (via drill 0.35)
  Top 0.406: v38.1,45.72 40.13,47.75 R2.1
  Bottom 0.406: v38.1,45.72 IC1.4
N$3  (via drill 0.35)
  Top 0.406: v55.88,47.62 R3.1
  Bottom 0.305: IC1.6 40.64,40.01
  Bottom 0.406: IC1.6 40.64,43.81 44.45,47.62 v55.88,47.62
N$4  (via drill 0.35)
  Top 0.406: v99.06,50.8 R4.1
  Bottom 0.305: 111.76,40.01 IC2.2
  Bottom 0.406: IC2.2 111.76,44.45 105.41,50.8 v99.06,50.8
N$5  (via drill 0.35)
  Top 0.406: v116.2,46.99 116.84,47.62 R5.1
  Bottom 0.406: IC2.4 114.3,45.09 v116.2,46.99
N$6  (via drill 0.35)
  Top 0.406: v128.91,50.8 R6.1
  Bottom 0.406: IC2.6 116.84,43.18 124.46,50.8 v128.91,50.8
N$7
  Top 0.61: LED1.K R1.2
N$8
  Top 0.61: R2.2 LED2.K
N$9
  Top 0.61: R3.2 62.1,50.67 LED3.K
N$10
  Top 0.61: R4.2 LED4.K
N$11
  Top 0.61: R5.2 LED5.K
N$12
  Top 0.61: R6.2 LED6.K
N$13
  Bottom 0.305: R21.1 117.16,75.25 118.75,76.83 118.75,80.01 | U1.11 118.11,82.55 118.75,81.92 118.75,80.01 | U1.9 118.75,80.01
  Bottom 0.406: U1.9 112.97,80.01 R18.1 | R20.2 R21.1
N$14
  Bottom 0.61: LED_PWR.A RLED.1
N$15  (via drill 0.35)
  Top 0.406: R7.1 v22.86,25.4
  Bottom 0.406: v22.86,25.4 31.75,25.4 36.83,30.48 IC1.12
N$16  (via drill 0.35)
  Top 0.406: v40.64,28.57 40.77,28.45 R8.1
  Bottom 0.406: v40.64,28.57 39.37,29.84 IC1.10
N$17  (via drill 0.35)
  Top 0.406: R9.1 50.8,28.45 v50.86,28.51
  Bottom 0.406: v50.86,28.51 44.35,35.03 IC1.8
N$18  (via drill 0.35)
  Top 0.406: v102.87,25.4 R10.1
  Bottom 0.305: 113.03,36.2 IC2.12
  Bottom 0.406: IC2.12 113.03,31.11 107.31,25.4 v102.87,25.4
N$19  (via drill 0.35)
  Top 0.406: v118.11,30.48 119.63,28.96 R11.1
  Bottom 0.406: IC2.10 115.57,33.02 v118.11,30.48
N$20  (via drill 0.35)
  Top 0.406: v128.91,25.4 R12.1
  Bottom 0.406: IC2.8 127.74,25.4 v128.91,25.4
N$21
  Top 0.61: R7.2 LED7.K
N$22
  Top 0.61: R8.2 LED8.K
N$23
  Top 0.61: R9.2 LED9.K
N$24
  Top 0.61: R10.2 LED10.K
N$25
  Top 0.61: LED11.K 115.7,25.27 R11.2
N$26
  Top 0.61: R12.2 LED12.K
N$27
  Bottom 0.305: U1.7 120.65,78.74 120.02,79.38 120.02,80.64 120.65,81.28 U1.5
  Bottom 0.406: U1.7 121.92,78.68 121.92,76.83 | 121.92,76.83 R16.1 | 121.92,76.83 125.73,76.83 | 125.73,76.83 R13.1 | 125.73,76.83 R15.2
N$28
  Bottom 0.61: TEENSY_A.3V3_LO 174.88,13.34 SJ_A.1
N$30
  Bottom 1.016: SJ1.1 17.65,75.06 COUT1.+ 17.78,80.09 | U3.3 17.78,80.09 | 17.78,80.09 15.48,80.09 RLED.2
N$31
  Bottom 0.61: 86.23,75.16 T2.1 | T2.1 88.67,75.16 91.44,72.39 R23.2 | R25.2 81.56,75.16 T2.1
N$32
  Bottom 0.406: R27.2 126.11,86.36 U1.1
N$33
  Bottom 0.61: 63.37,75.16 T1.1 | T1.1 65.81,75.16 68.58,72.39 R24.2 | T1.1 58.52,75.16 R26.2
N$35
  Bottom 0.406: R27.1 LICK_A0_LED.K
N$41
  Bottom 0.406: R28.1 LICK_A1_LED.K
N$44  (via drill 0.35)
  Top 0.406: v114.3,86.87 114.17,87 v111.76,87
  Bottom 0.406: U1.14 114.81,86.36 v114.3,86.87 | v111.76,87 108.84,89.92 R28.2
N$46
  Bottom 0.61: TEENSY_B.3V3_LO 251.08,13.34 SJ_B.1
N$91  (via drill 0.35)
  Top 0.406: v292.1,45.72 294.13,47.75 R30.1
  Bottom 0.406: v292.1,45.72 IC4.4
N$92  (via drill 0.35)
  Top 0.406: v309.88,47.62 R31.1
  Bottom 0.305: IC4.6 294.64,40.01
  Bottom 0.406: IC4.6 294.64,43.81 298.45,47.62 v309.88,47.62
N$93  (via drill 0.35)
  Top 0.406: v353.06,50.8 R32.1
  Bottom 0.305: 365.76,40.01 IC3.2
  Bottom 0.406: IC3.2 365.76,44.45 359.41,50.8 v353.06,50.8
N$94  (via drill 0.35)
  Top 0.406: v370.2,46.99 370.84,47.62 R33.1
  Bottom 0.406: IC3.4 368.3,45.09 v370.2,46.99
N$95  (via drill 0.35)
  Top 0.406: v382.9,50.8 R34.1
  Bottom 0.406: IC3.6 370.84,43.18 378.46,50.8 v382.9,50.8
N$96
  Top 0.61: R30.2 LED14.K
N$97
  Top 0.61: R31.2 316.1,50.67 LED15.K
N$98
  Top 0.61: R32.2 LED16.K
N$99
  Top 0.61: R33.2 LED17.K
N$100
  Top 0.61: R34.2 LED18.K
N$102  (via drill 0.35)
  Top 0.406: R35.1 v276.86,25.4
  Bottom 0.406: v276.86,25.4 285.12,25.4 290.83,31.11 IC4.12
N$103  (via drill 0.35)
  Top 0.406: v294.64,28.57 294.77,28.45 R36.1
  Bottom 0.406: v294.64,28.57 293.37,29.84 IC4.10
N$104  (via drill 0.35)
  Top 0.406: R37.1 304.8,28.45 v304.86,28.51
  Bottom 0.406: v304.86,28.51 298.35,35.03 IC4.8
N$105  (via drill 0.35)
  Top 0.406: v353.69,25.4 R38.1
  Bottom 0.305: 367.03,36.2 IC3.12
  Bottom 0.406: IC3.12 367.03,31.11 361.31,25.4 v353.69,25.4
N$106  (via drill 0.35)
  Top 0.406: v372.11,30.48 373.63,28.96 R39.1
  Bottom 0.406: IC3.10 369.57,33.02 v372.11,30.48
N$107  (via drill 0.35)
  Top 0.406: v382.9,25.4 R40.1
  Bottom 0.406: IC3.8 381.74,25.4 v382.9,25.4
N$108
  Top 0.61: R35.2 LED19.K
N$109
  Top 0.61: R36.2 LED20.K
N$110
  Top 0.61: R37.2 LED21.K
N$111
  Top 0.61: R38.2 LED22.K
N$112
  Top 0.61: R39.2 LED23.K
N$113
  Top 0.61: R40.2 LED24.K
N$115
  Bottom 0.61: 355.6,75.16 354.86,75.16 353.82,76.2 R53.2 | 355.6,75.16 T4.1 358.64,75.16 | R51.2 355.6,71.89 355.6,75.16
N$116
  Bottom 0.406: R52.2 332.74,71.89
  Bottom 0.61: 332.74,75.16 332,75.16 330.96,76.2 R54.2 | 332.74,75.16 T3.1 335.79,75.16 | 332.74,71.89 332.74,75.16
N$117  (via drill 0.35)
  Top 0.406: R29.1 v276.86,50.8
  Bottom 0.406: IC4.2 289.56,44.45 283.21,50.8 v276.86,50.8
N$118
  Top 0.61: LED13.K R29.2
N$119
  Bottom 0.305: U2.7 288.29,78.74 287.65,79.38 287.65,80.64 288.29,81.28 U2.5
  Bottom 0.406: U2.7 289.56,78.68 289.56,76.83 | 289.56,76.83 R44.1 | 289.56,76.83 293.37,76.83 | 293.37,76.83 R41.1 | 293.37,76.83 R43.2
N$128
  Bottom 0.305: R49.1 284.8,75.25 286.38,76.83 286.38,80.01 | U2.11 285.75,82.55 286.38,81.92 286.38,80.01 | U2.9 286.38,80.01
  Bottom 0.406: U2.9 280.61,80.01 R46.1 | R48.2 R49.1
N$132
  Bottom 0.406: R55.2 293.75,86.36 U2.1
N$133
  Bottom 0.406: R55.1 LICK_B0_LED.K
N$134
  Bottom 0.406: R56.1 LICK_B1_LED.K
N$135  (via drill 0.35)
  Top 0.406: v281.94,86.87 281.81,87 v279.4,87
  Bottom 0.406: U2.14 282.45,86.36 v281.94,86.87 | v279.4,87 276.48,89.92 R56.2
RESET_A
  Top 0.406: TEENSY_A.RESET 170.18,56.52 171.45,57.78 176.53,57.78 RESET_A.1
RESET_B
  Top 0.406: TEENSY_B.RESET 244.47,52.07 234.95,52.07 234.31,52.7 232.41,52.7 229.24,55.88 RESET_B.1
SOLN_A0  (via drill 0.35)
  Top 0.406: TEENSY_A.12/MISO 151.13,47.62 v151.13,56.52
  Bottom 0.406: R23.1 100.46,69.85 112.39,69.85 117.03,65.22 142.43,65.22 v151.13,56.52
SOLN_A1  (via drill 0.35)
  Top 0.406: v85.09,72.39 95.89,61.59 v127,61.59 | TEENSY_A.24 153.67,50.16 v153.67,52.07
  Bottom 0.406: v153.67,52.07 144.15,61.59 v127,61.59
  Bottom 0.61: R24.1 v85.09,72.39
SOLN_B0  (via drill 0.35)
  Top 0.406: TEENSY_B.12/MISO 237.49,45.09 v251.46,45.09 | v273.69,56.52 v268.61,56.52
  Bottom 0.406: v273.69,56.52 283.21,66.04 341,66.04 346.71,71.75 R51.1 | v251.46,45.09 252.73,45.09 264.16,56.52 v268.61,56.52
SOLN_B1  (via drill 0.35)
  Top 0.406: TEENSY_B.24 246.38,46.35 247.65,47.62 v252.09,47.62 | v273.69,59.69 v268.61,59.69
  Bottom 0.406: v273.69,59.69 281.94,67.94 292.1,67.94 295.91,71.75 R52.1 | v252.09,47.62 254,47.62 266.06,59.69 v268.61,59.69
VCC_1  (via drill 0.35, 1)
  Top 0.406: 126.36,75.56 v129.54,75.56 | v107.31,79.38 107.31,81.92 LICK_A1_LED.A | LICK_A0_LED.A 134.62,85.09 v127.25,85.09
  Top 0.61: LED8.A 40.01,22.23 62.23,22.23 64.77,24.77 LED9.A | v29.84,48.26 32.38,50.8 LED2.A | v107.31,46.99 111.12,50.8 LED5.A | 121.92,73.03 116.84,73.03 | 116.84,73.03 107.31,73.03 | v107.31,79.38 107.31,73.03 | v116.84,71.12 116.84,73.03 | v121.92,71.12 121.92,73.03 | 107.31,73.03 v107.31,68.58 | v127.25,85.09 126.36,84.2 126.36,75.56 126.36,74.93 124.46,73.03 121.92,73.03 | v149.22,45.09 143.51,50.8 LED6.A
  Bottom 0.406: R22.2 109.47,80.71 R19.2 107.63,79.69 v107.31,79.38 | LED2.A 46.35,60.33 46.35,74.3 v48.9,76.83 | IC1.14 34.29,38.1 | v107.31,46.99 107.31,38.1 | v127.25,85.09 125.98,85.09 124.71,83.82 U1.3 | v127.25,85.09 127.31,85.03 | v127.25,85.09 127.95,84.39 R17.2 | v129.54,75.56 128.91,76.2 R14.2 | v116.84,71.12 R21.2 | v121.92,71.12 R16.2
  Bottom 0.61: 36.83,51.44 LED2.A | 110.39,34.92 IC2.14 110.49,36.83 109.22,38.1 107.31,38.1 87.63,38.1 | 17.14,53.98 13.34,53.98 11.43,52.07 LED1.A | 17.14,38.1 17.14,32.38 11.43,26.67 LED7.A | v29.84,48.26 27.94,46.35 27.94,38.1 | LED3.A 64.77,38.1 LED9.A | 118.11,4.45 118.11,12.7 113.03,17.78 LED11.A | 150.5,25.4 150.5,4.45 | LED12.A 150.5,25.4 | v149.22,45.09 150.5,43.81 150.5,25.4
  Bottom 1.016: 87.63,38.1 64.77,38.1 34.29,38.1 27.94,38.1 17.14,38.1 17.14,53.98 17.14,62.23 12.7,66.67 SJ1.2 | v107.31,68.58 105.41,68.58 LED4.A 87.63,38.1 | 87.63,38.1 LED10.A 87.63,17.14 100.33,4.45 118.11,4.45 150.5,4.45 180.97,4.45 183.51,6.99 | VCC2_VCC1.2 189.87,4.45 187.32,6.99 183.51,6.99 | SJ_A.2 180.97,9.53 183.51,6.99
VCC_2  (via drill 0.35, 1)
  Top 0.406: v274.95,79.38 274.95,81.92 LICK_B1_LED.A | v294.89,85.09 302.26,85.09 LICK_B0_LED.A | v295.91,75.56 294.89,75.56
  Top 0.61: LED23.A 363.22,25.4 v361.31,23.5 | v274.95,70.48 v284.48,70.48 v289.56,70.48 291.46,70.48 294.89,73.91 294.89,75.56 v294.89,85.09 | LED17.A 359.41,43.18 v359.41,40.64
  Bottom 0.406: R50.2 277.11,80.71 R47.2 275.27,79.69 v274.95,79.38 | v294.89,85.09 293.62,85.09 292.35,83.82 U2.3 | v294.89,85.09 294.95,85.03 | v294.89,85.09 295.59,84.39 R45.2 | v359.41,40.64 359.41,38.1 | v284.48,70.48 R49.2 | v289.56,70.48 R44.2 | IC3.14 364.49,38.1 | IC4.14 288.29,38.1 | v295.91,75.56 296.55,76.2 R42.2
  Bottom 0.61: v361.31,23.5 343.54,23.5 LED22.A 341.63,38.1 LED16.A | 271.14,22.86 288.29,22.86 LED20.A | 271.14,29.21 267.97,29.21 265.43,26.67 LED19.A | 256.41,8.26 256.54,8.26 | LED21.A 318.77,38.1 LED15.A | 256.1,7.81 256.1,7.94 | LED14.A 287.65,53.98 271.14,53.98 267.33,53.98 265.43,52.07 LED13.A | IC4.14 288.19,34.92 | v381,83.82 393.7,83.82
  Bottom 1.016: 271.14,38.1 271.14,53.98 271.14,62.23 274.95,66.04 v274.95,70.48 v274.95,79.38 | 271.14,38.1 271.14,29.21 271.14,22.86 256.54,8.26 | 256.54,8.26 256.1,7.81 252.73,4.45 215.26,4.45 212.72,6.99 208.91,6.99 206.38,4.45 VCC2_VCC1.1 | 271.14,38.1 288.29,38.1 318.77,38.1 341.63,38.1 359.41,38.1 364.49,38.1 394.97,38.1 | VCC_OUT.P$1 393.7,83.82 393.7,67.94 395.61,66.04 395.61,50.8 | 394.97,38.1 395.61,38.73 395.61,50.8 | LED24.A 394.97,38.1 | LED18.A 395.61,50.8 | SJ_B.2 255.27,9.53 256.54,8.26
VIN  (via drill 0.35, 1)
  Top 0.61: v373.38,83.82 363.86,83.82
  Top 1.016: v179.71,74.93 136.53,74.93 127,65.41 105.41,65.41 95.89,74.93 91.44,74.93 | 91.44,74.93 68.58,74.93 | J2.1 68.58,74.93 | J3.1 91.44,74.93 | 68.58,74.93 43.81,74.93 | 43.81,74.93 38.37,74.93 J1.PWR | v43.81,76.83 43.81,74.93 | v226.69,74.93 248.28,74.93 257.18,66.04 290.19,66.04 299.08,74.93 341,74.93 | 341,74.93 357.5,74.93 363.86,81.28 363.86,83.82 J4.1 | J5.1 341,74.93
  Bottom 1.016: v226.69,74.93 v179.71,74.93 | J2.1 70.14,89.24 D1.C | J3.1 93,89.24 D2.C | J5.1 342.56,89.24 D3.C | J4.1 365.42,89.24 D4.C | J1.PWR 25.4,80.28 | 25.4,80.28 24.09,80.28 U3.1 | CIN1.+ 25.4,80.28
VIN_A
  Bottom 0.61: TEENSY_A.VIN 172.97,8 SJ_A.3
VIN_B
  Bottom 0.61: SJ_B.3 249.17,8 TEENSY_B.VIN
VOUT-2
  Bottom 1.016: T1.2 65.41,77.47 | 65.41,77.47 T1.4 | SW1.2 56.52,85.09 D1.A | J2.2 66.04,85.39 D1.A | D1.A 65.75,77.81 65.41,77.47
VOUT-3
  Bottom 1.016: T2.2 88.9,77.47 | 88.9,77.47 T2.4 | J3.2 88.9,85.39 D2.A | D2.A 88.61,77.77 88.9,77.47 | SW2.2 80.01,85.09 D2.A
VOUT-5
  Bottom 1.016: T4.2 360.68,77.47 | 360.68,77.47 T4.4 | SW4.2 351.79,85.09 D4.A | J4.2 361.31,85.39 D4.A | D4.A 361.02,77.81 360.68,77.47
VOUT-6
  Bottom 1.016: T3.2 338.45,77.47 | 338.45,77.47 T3.4 | SW3.2 328.93,85.09 D3.A | J5.2 338.45,85.39 D3.A | D3.A 338.16,77.77 338.45,77.47

### Text on the board
bNames: AGND | AGND | 3V3_B | 3V3_A | AIN_B4 | VIN | GND | GND | VCC_2 | AIN_A4 | GND | AIN_B5 | AIN_A5 | VIN | AGND | VCC_1 | For USB or external power, / jumper SJ_A and SJ_B to VIN | 3V3_A | 3V3_B | VIN_A | VIN_B | Teensy Breakout A1a / PVG 5/2018